# EAGLE schematic Open-Source_Control_V2_R2 (EAGLE 9.3.0)
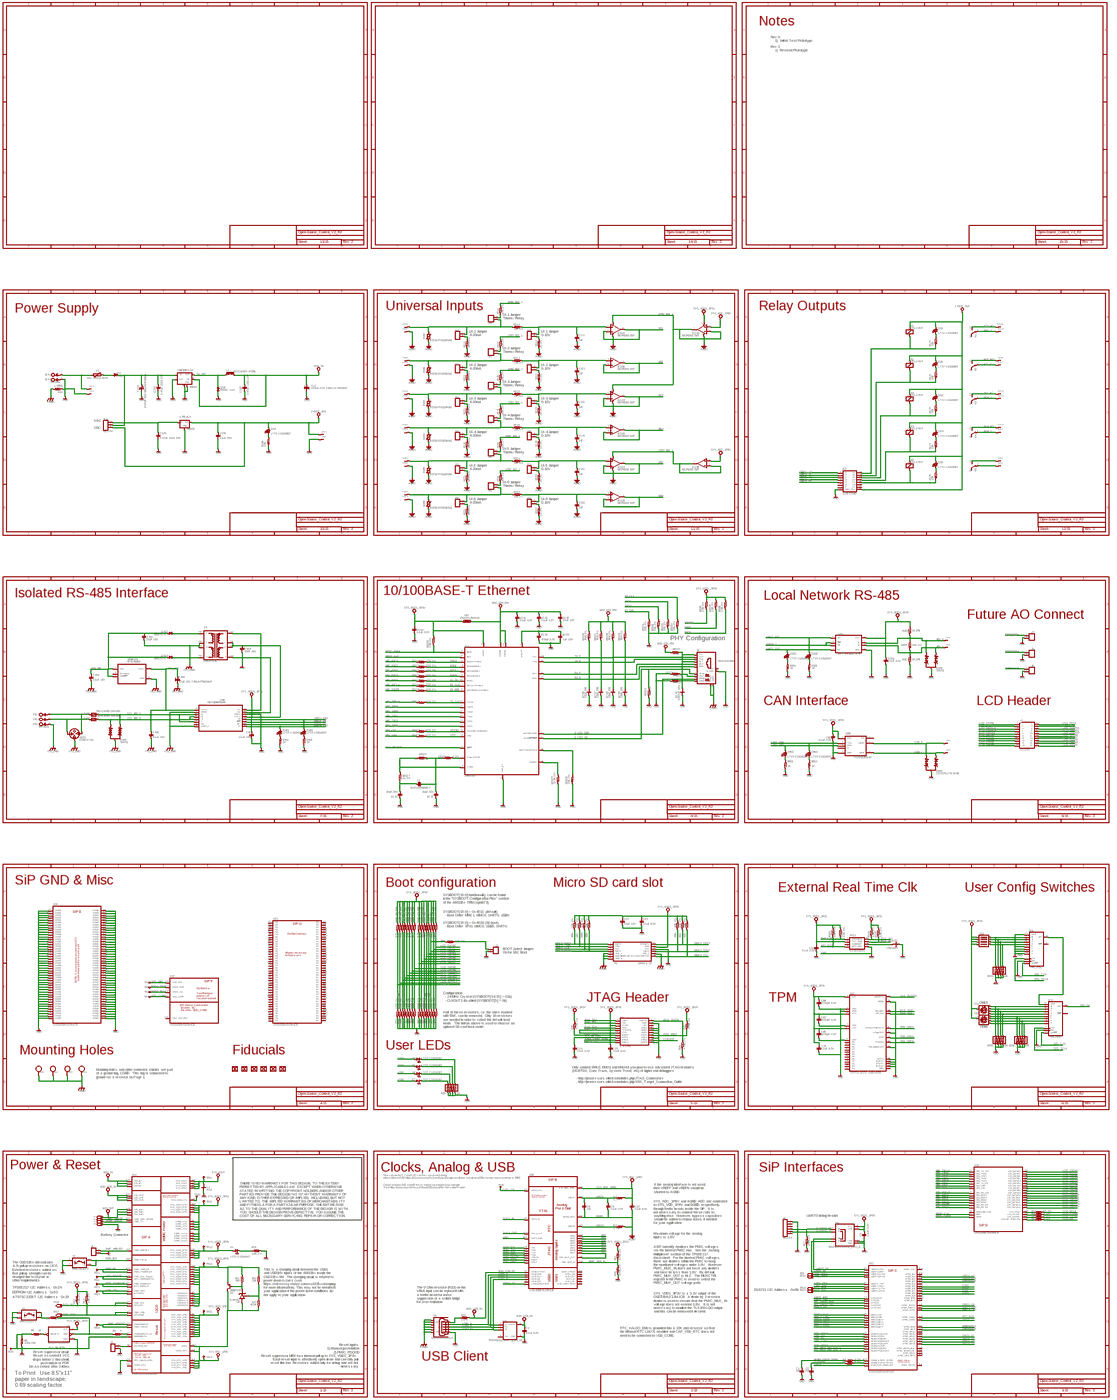
[diagram p0: schematic, sheet 1, overview]
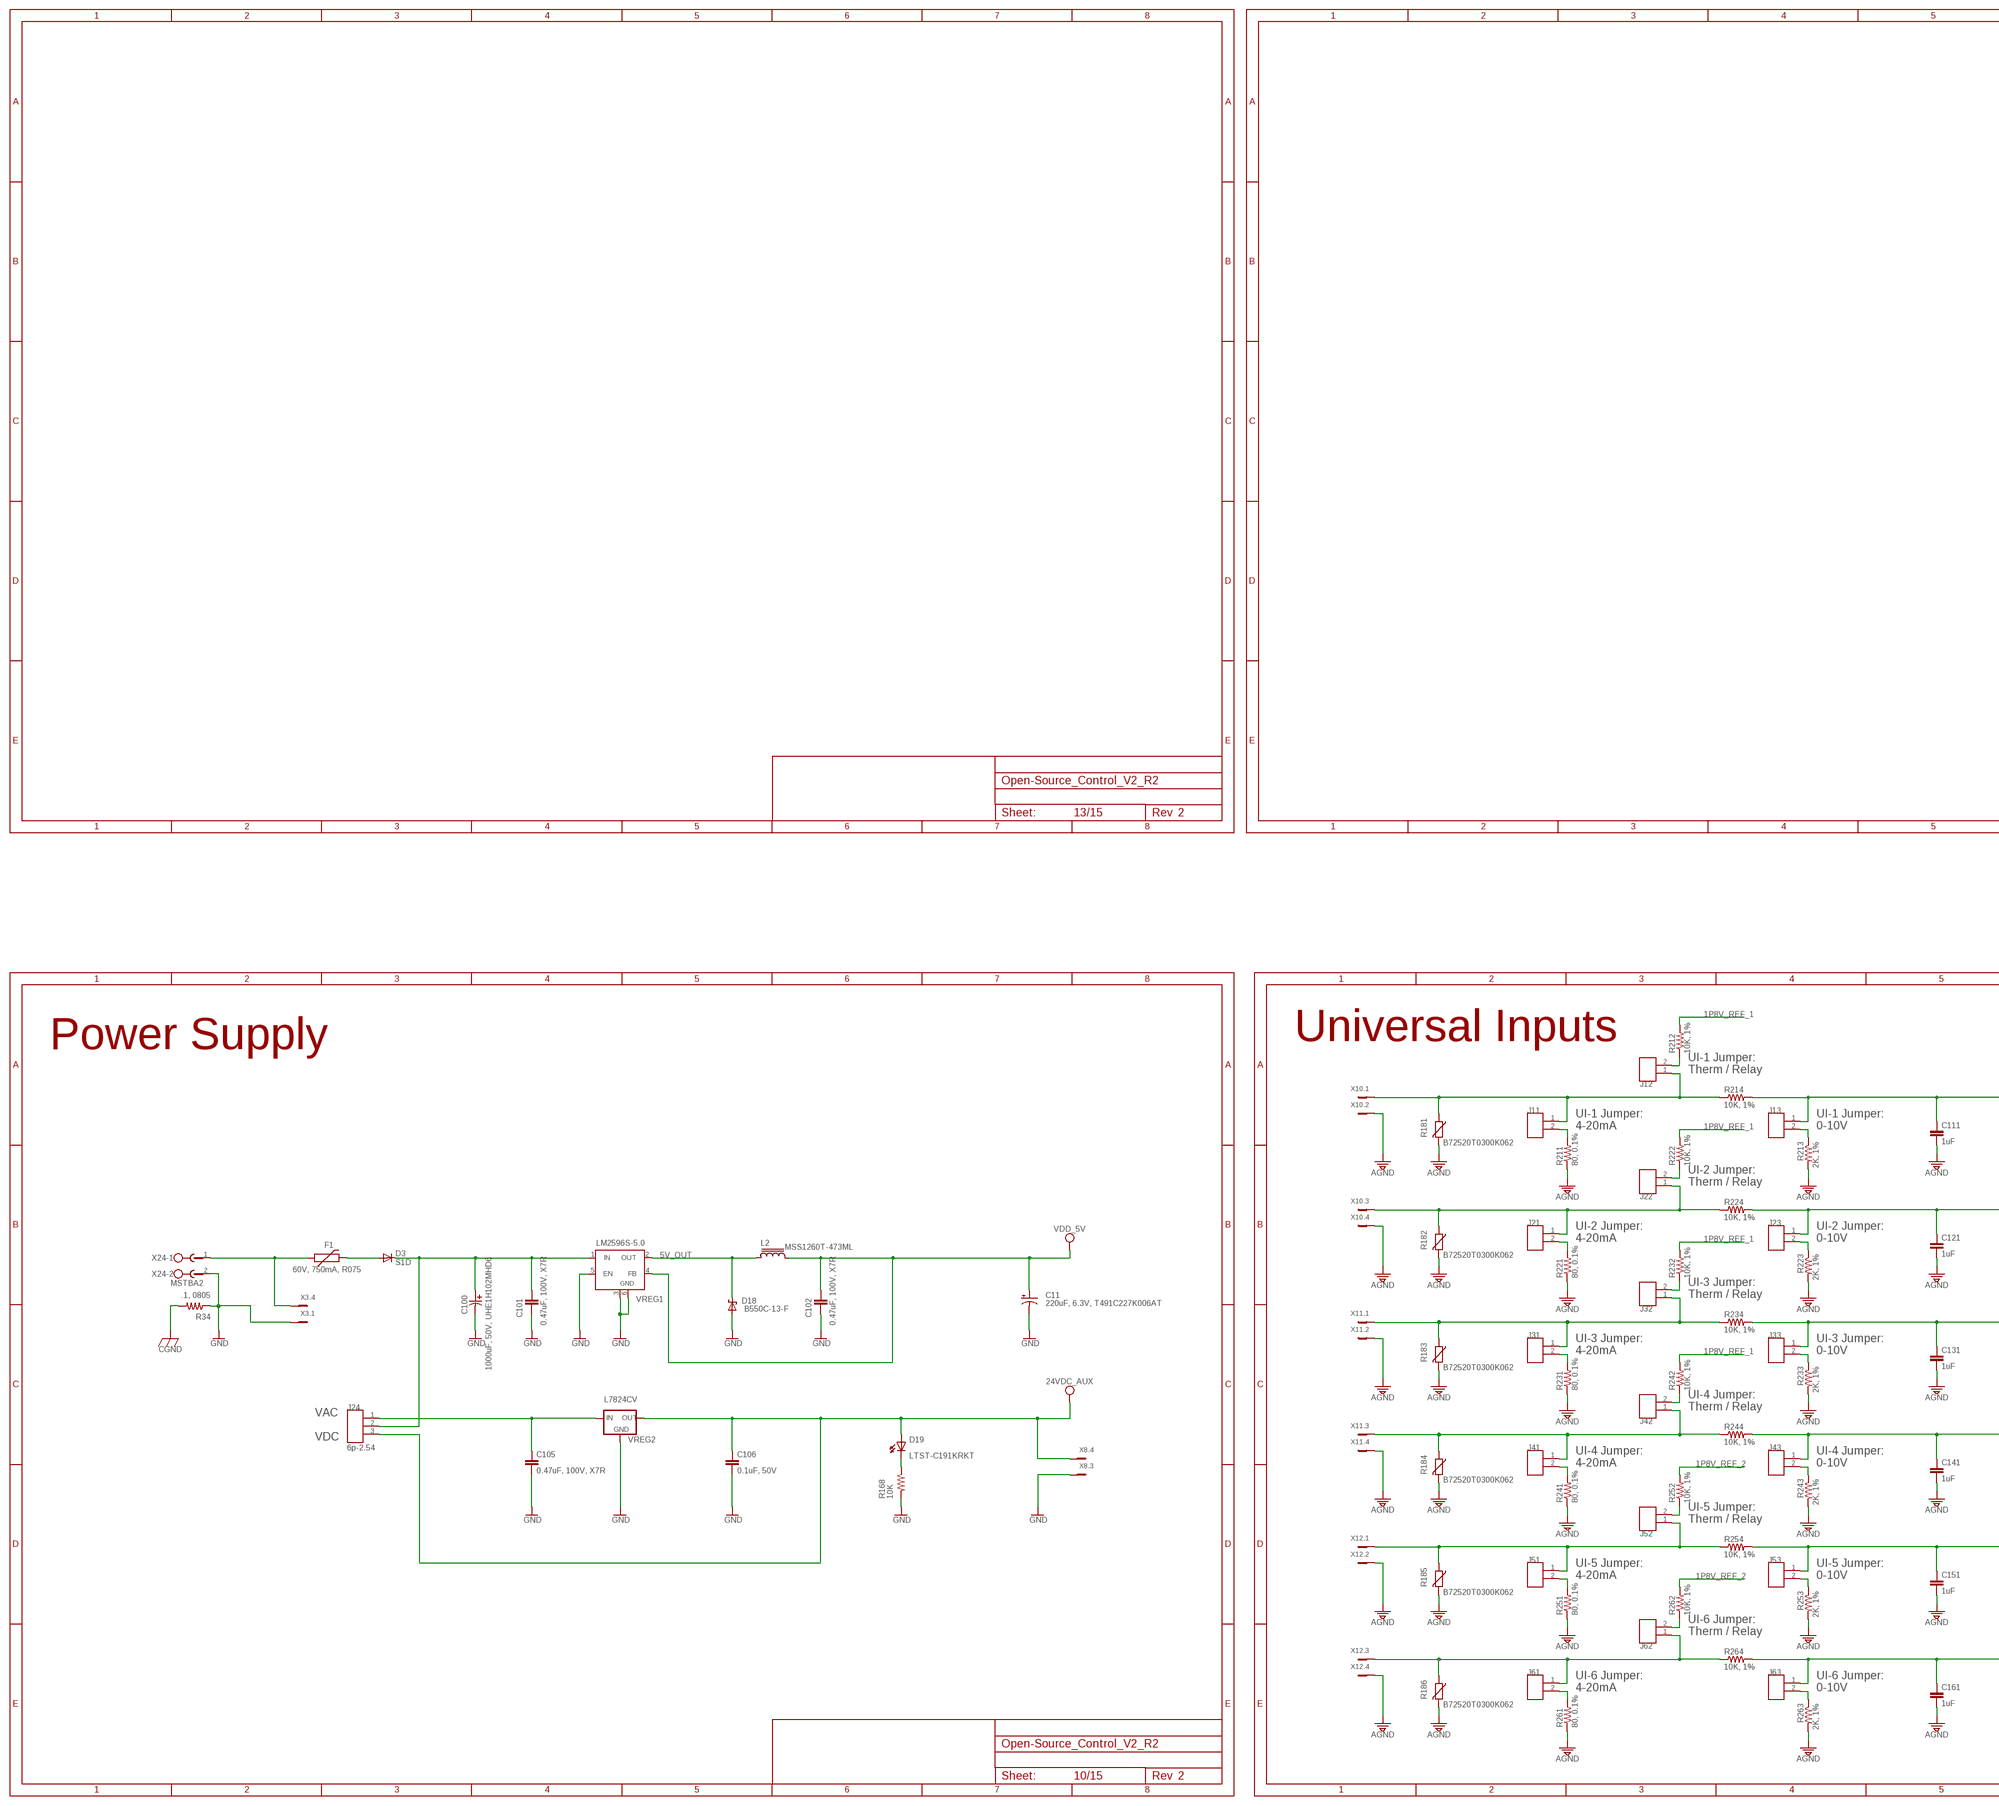
[diagram p1: schematic, sheet 1, part 1 of 6]
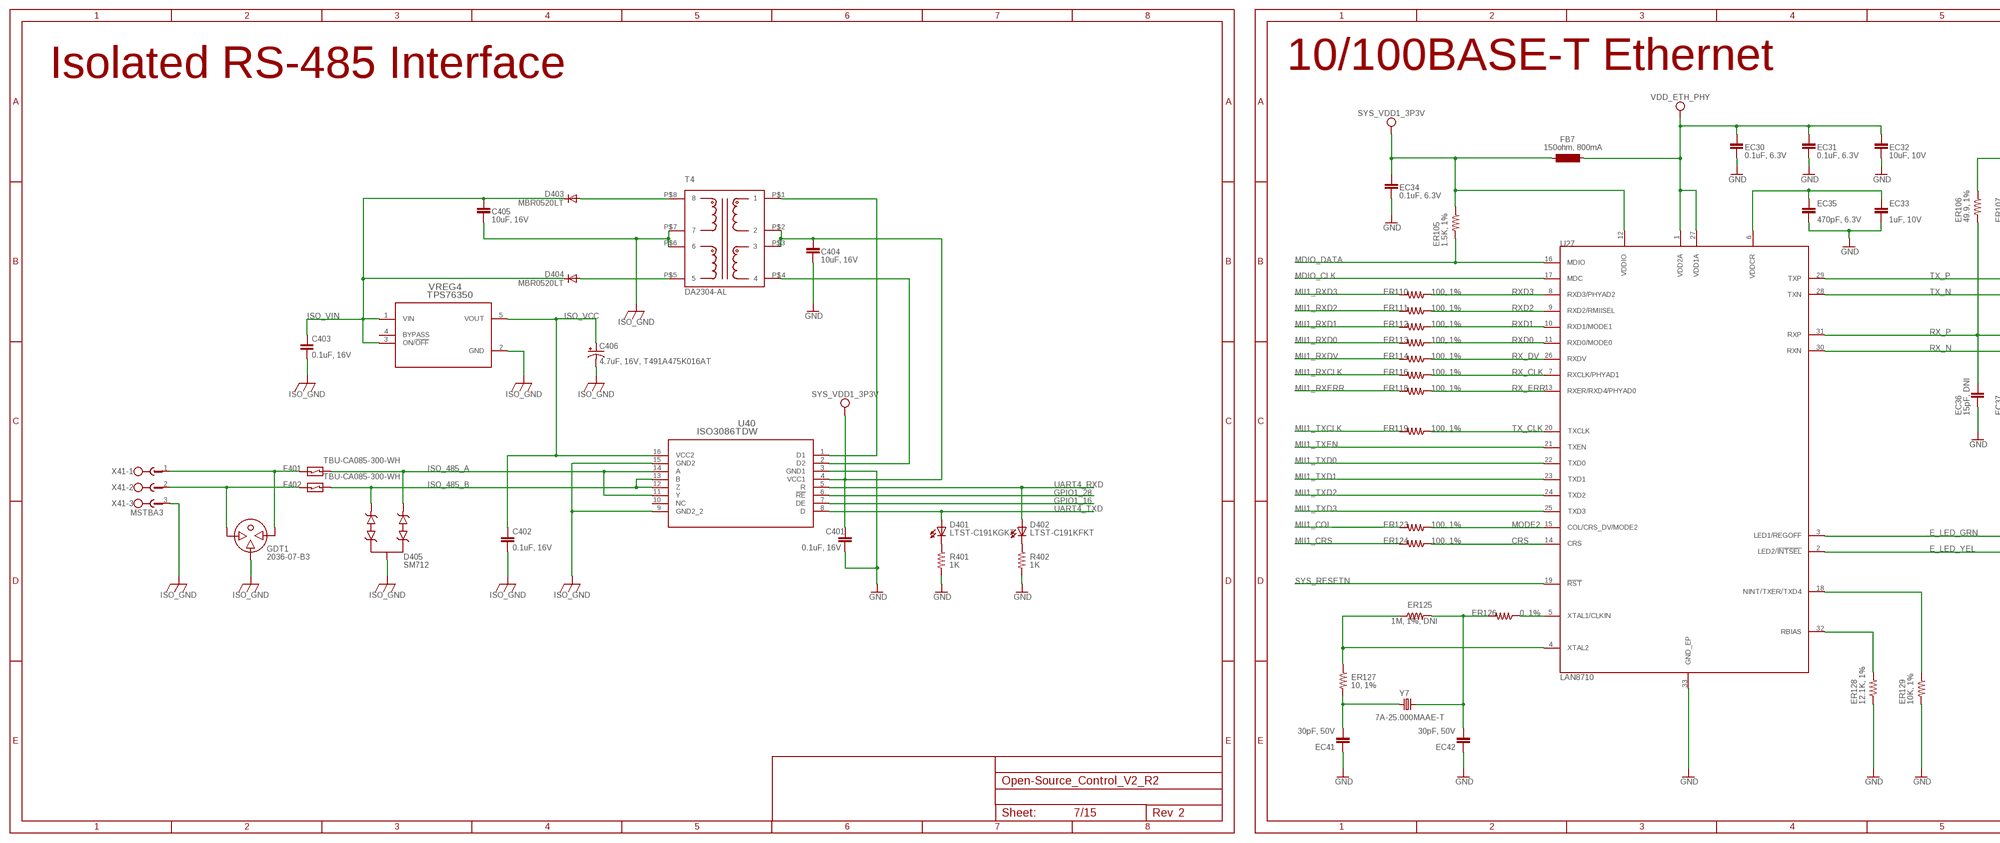
[diagram p2: schematic, sheet 1, part 2 of 6]
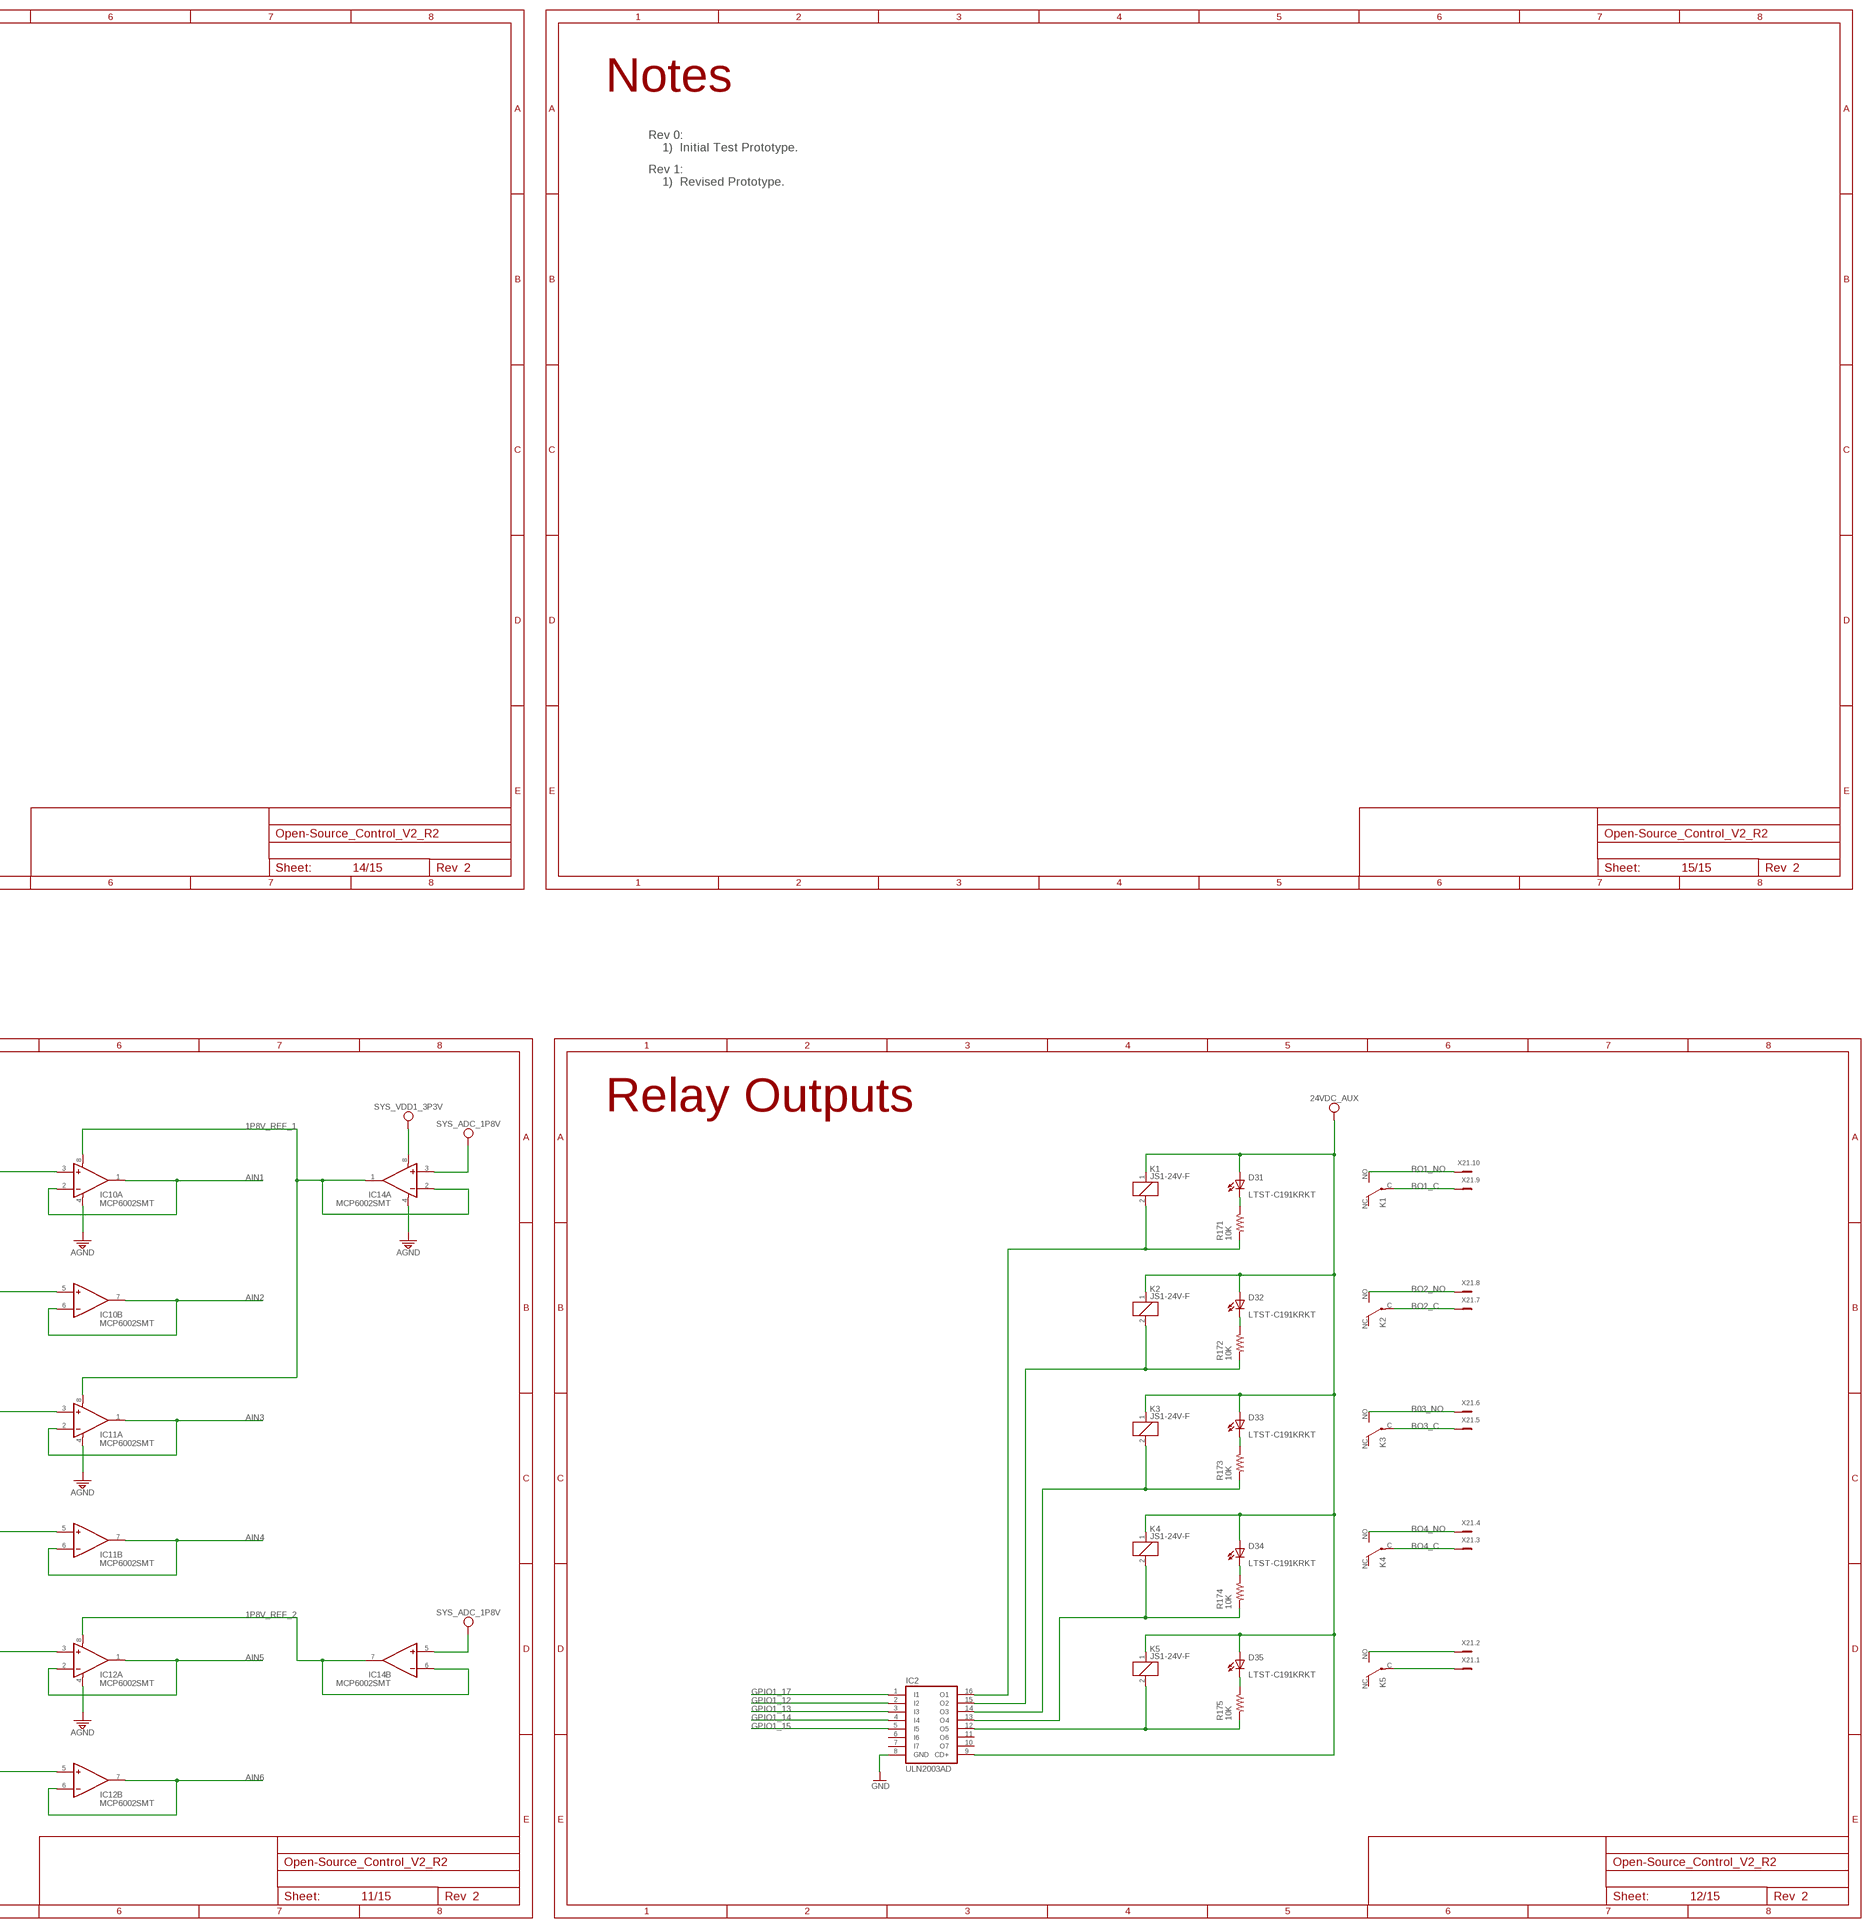
[diagram p3: schematic, sheet 1, part 3 of 6]
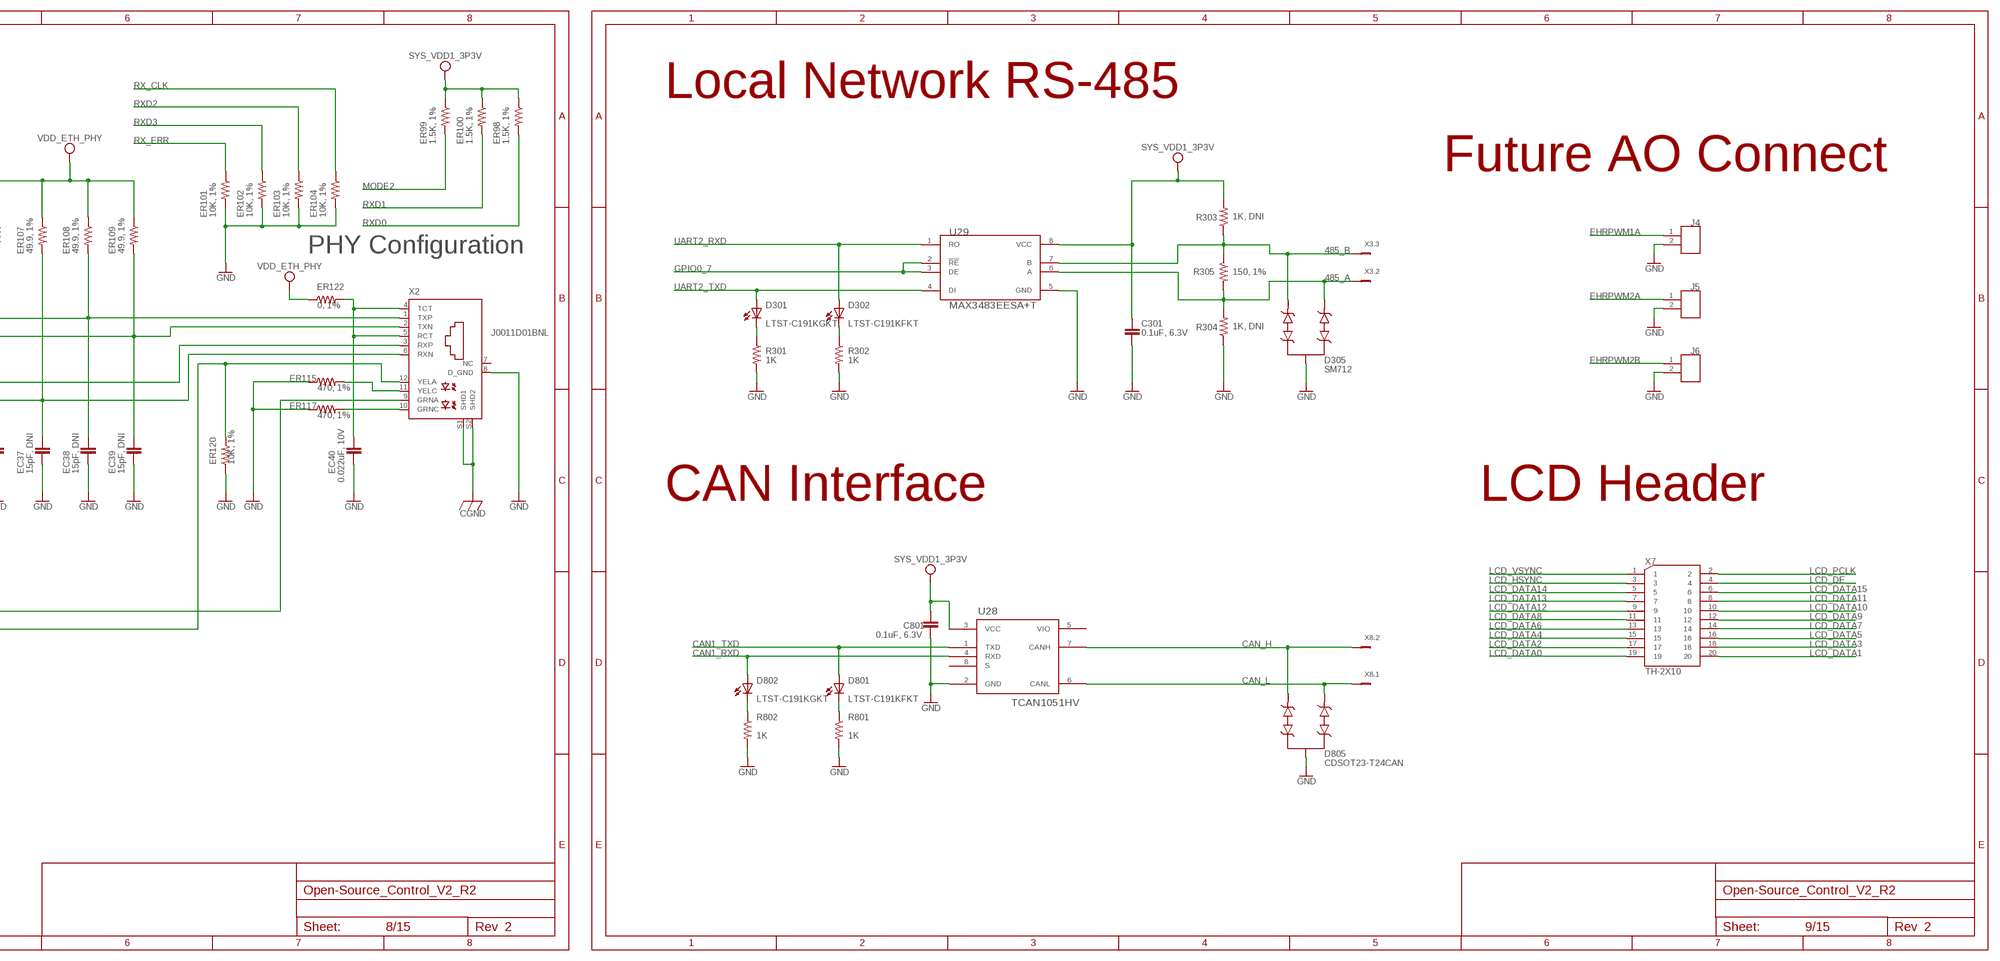
[diagram p4: schematic, sheet 1, part 4 of 6]
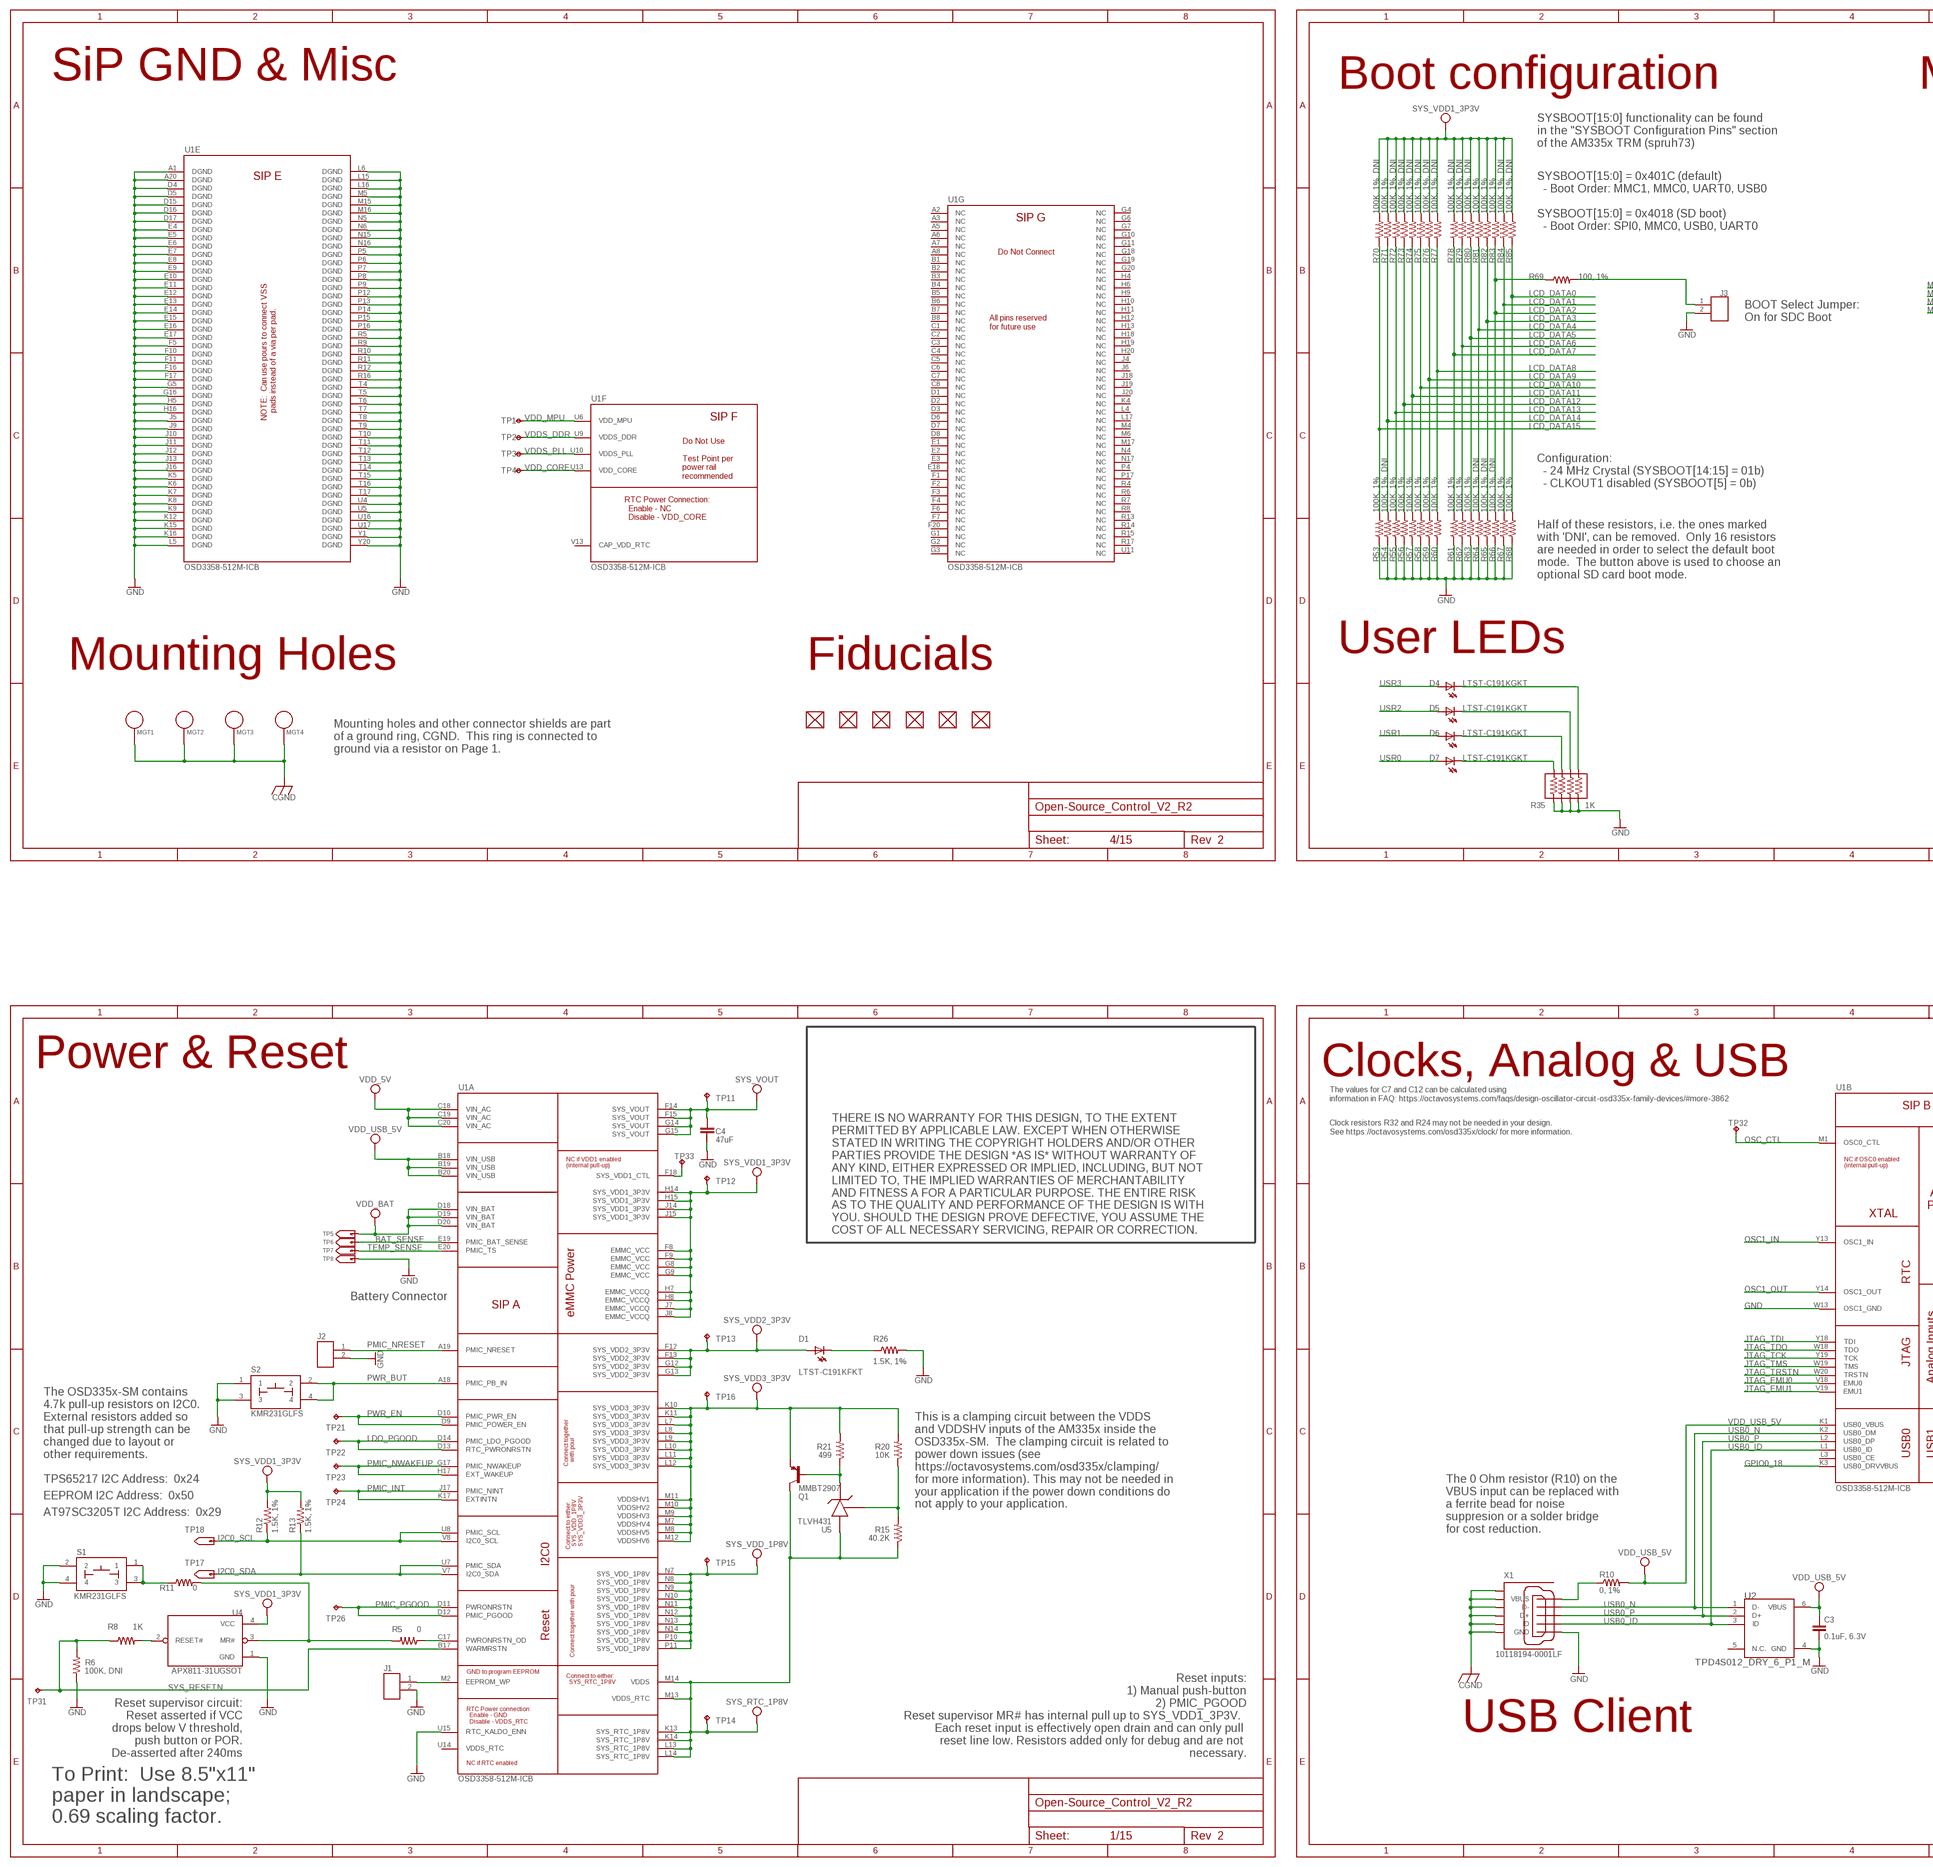
[diagram p5: schematic, sheet 1, part 5 of 6]
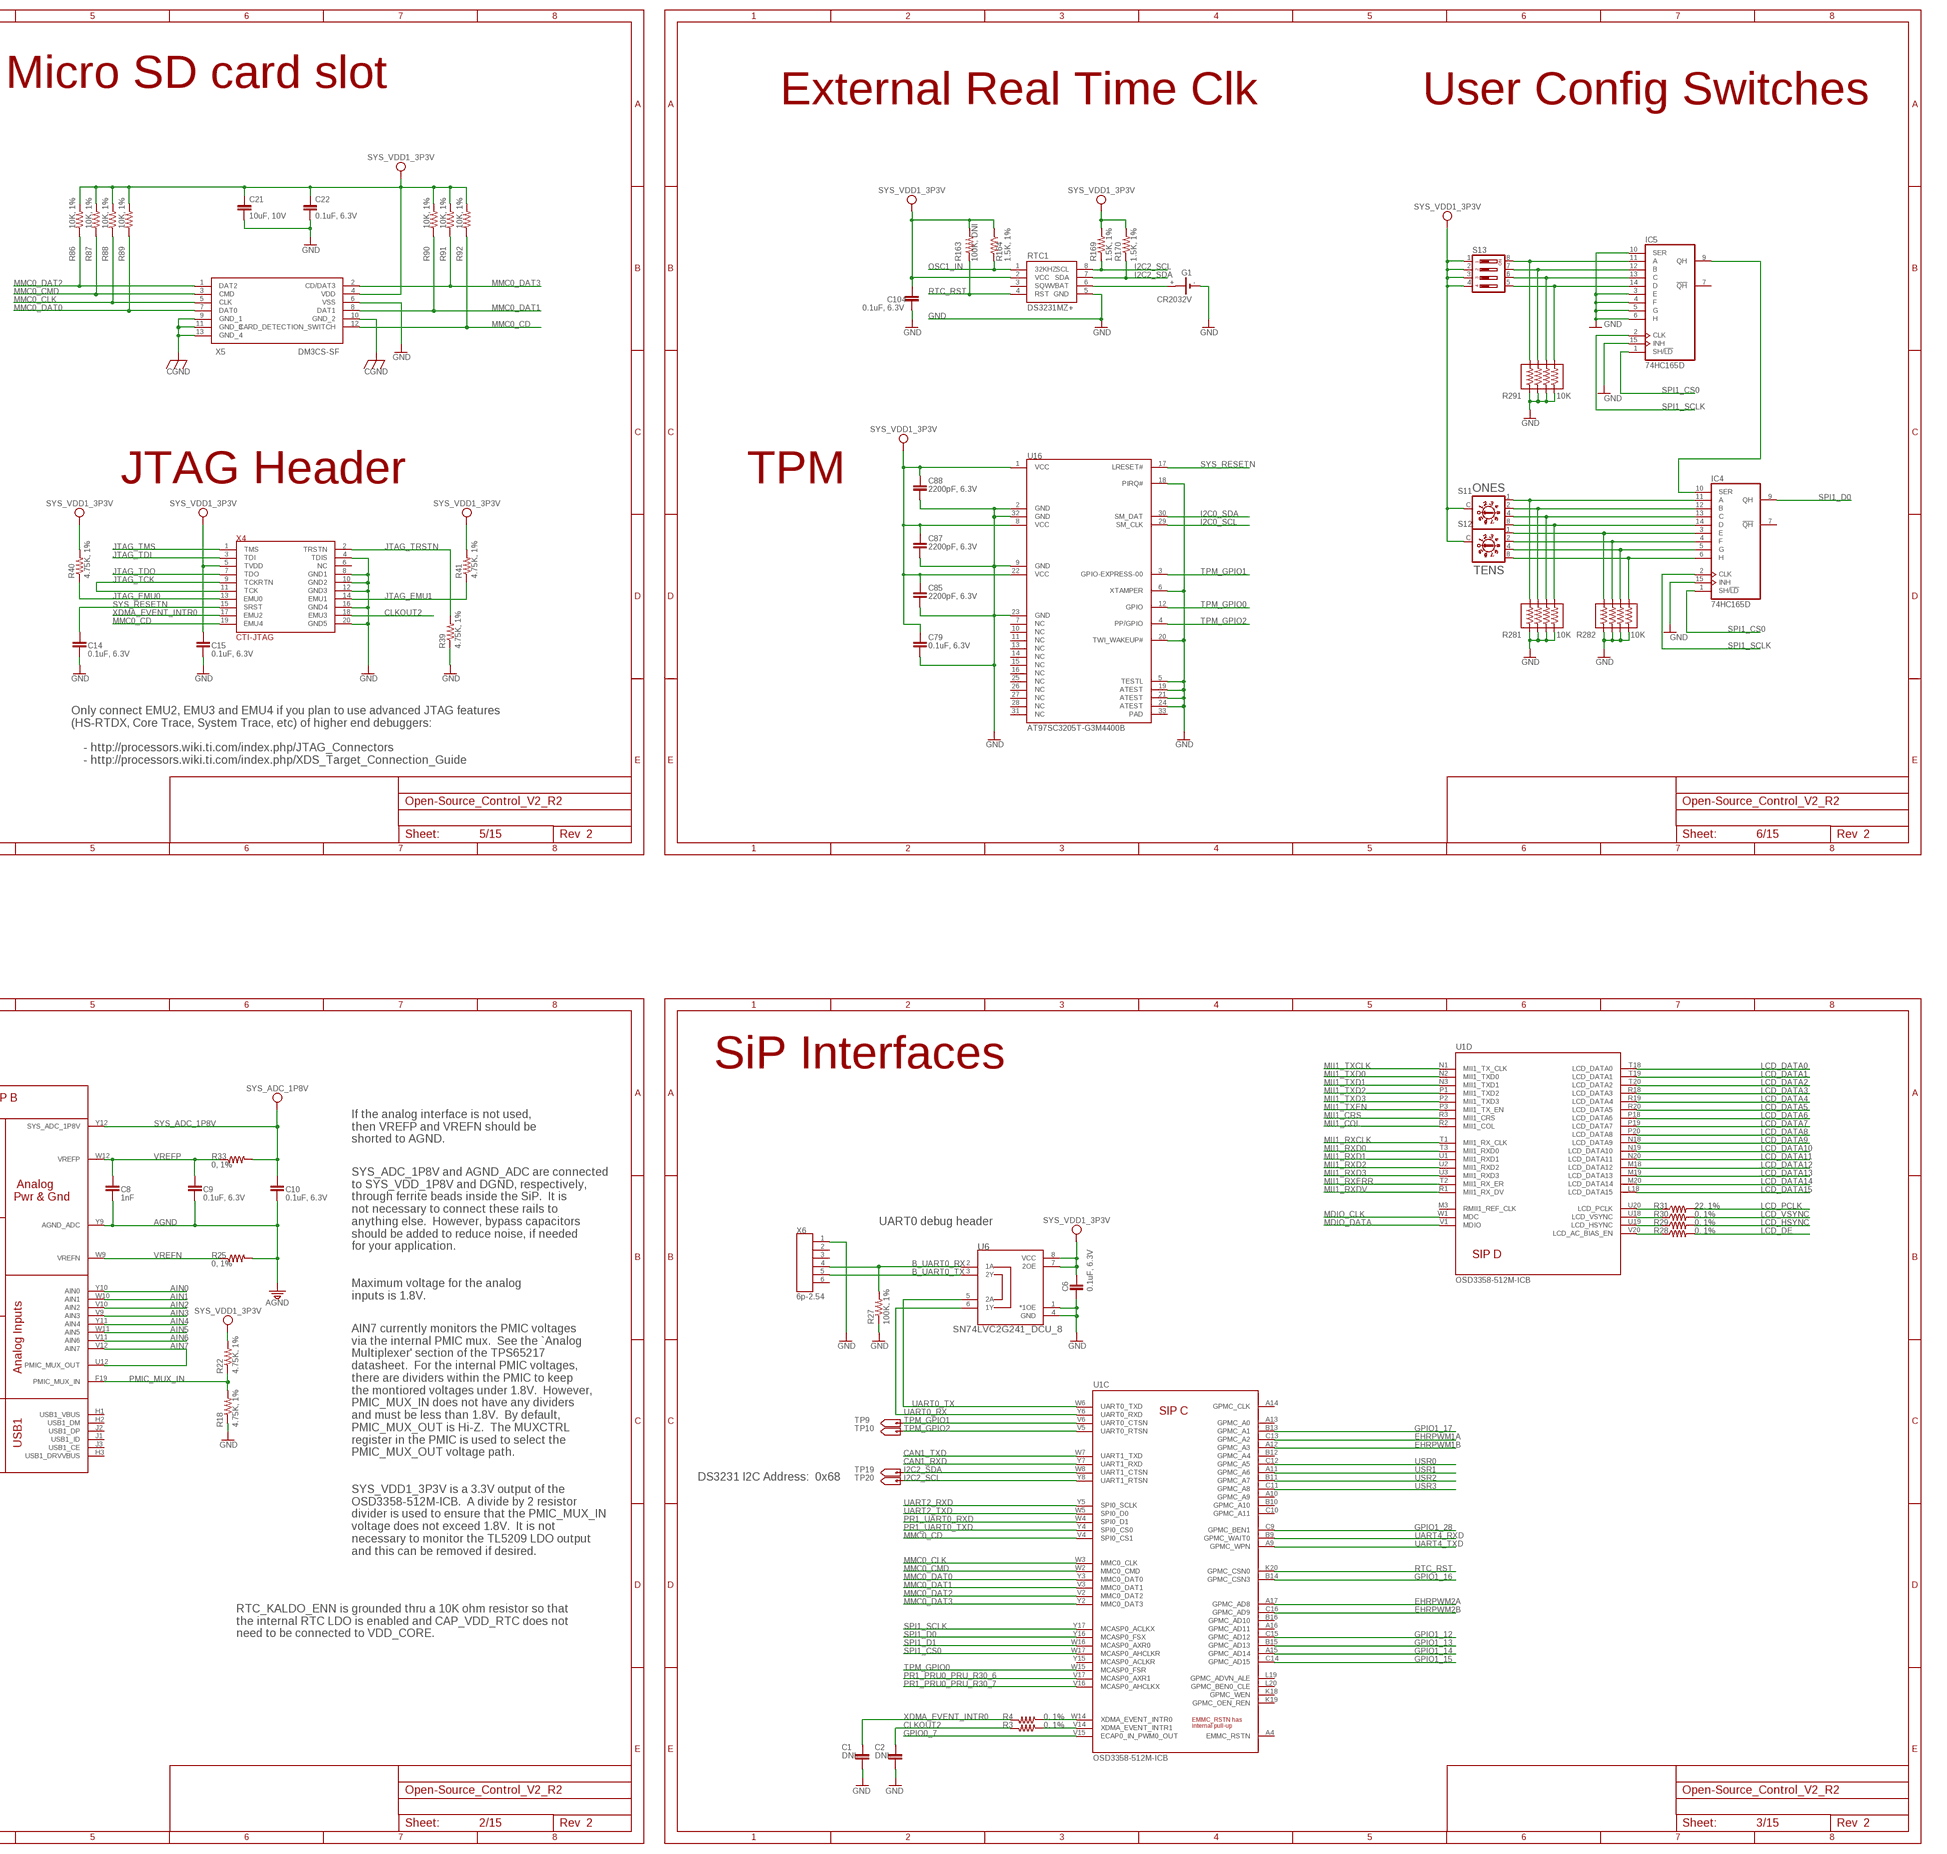
[diagram p6: schematic, sheet 1, part 6 of 6]

## Parts
C1  DNI  CC0603  [C0603]
C2  DNI  CC0603  [C0603]
C3  0.1uF, 6.3V  CC0402  [C0402]
C4  47uF  CC0805  [C0805]
C6  0.1uF, 6.3V  CC0402  [C0402]
C8  1nF  CC0402  [C0402]
C9  0.1uF, 6.3V  CC0402  [C0402]
C10  0.1uF, 6.3V  CC0402  [C0402]
C11  220uF, 6.3V, T491C227K006AT  CPOL-USC/6032-28R  [C/6032-28R]
C14  0.1uF, 6.3V  CC0402  [C0402]
C15  0.1uF, 6.3V  CC0402  [C0402]
C21  10uF, 10V  CC0805  [C0805]
C22  0.1uF, 6.3V  CC0402  [C0402]
C79  0.1uF, 6.3V  CC0402  [C0402]
C85  2200pF, 6.3V  CC0402  [C0402]
C87  2200pF, 6.3V  CC0402  [C0402]
C88  2200pF, 6.3V  CC0402  [C0402]
C100  1000uF, 50V, UHE1H102MHD6  UHE1H102MHD6  [PCAP_16X25-THRU-ELECT]
C101  0.47uF, 100V, X7R  4.7UF-1206-16V-(+80/-20%)  [1206]
C102  0.47uF, 100V, X7R  4.7UF-1206-16V-(+80/-20%)  [1206]
C104  0.1uF, 6.3V  CC0402  [C0402]
C105  0.47uF, 100V, X7R  4.7UF-1206-16V-(+80/-20%)  [1206]
C106  0.1uF, 50V  4.7UF-1206-16V-(+80/-20%)  [1206]
C111  1uF  CC0805  [C0805]
C121  1uF  CC0805  [C0805]
C131  1uF  CC0805  [C0805]
C141  1uF  CC0805  [C0805]
C151  1uF  CC0805  [C0805]
C161  1uF  CC0805  [C0805]
C301  0.1uF, 6.3V  CC0402  [C0402]
C401  0.1uF, 16V  CC0402  [C0402]
C402  0.1uF, 16V  CC0402  [C0402]
C403  0.1uF, 16V  CC0402  [C0402]
C404  10uF, 16V  CC0805  [C0805]
C405  10uF, 16V  CC0805  [C0805]
C406  4.7uF, 16V, T491A475K016AT  CPOL-USA/3216-18R  [A/3216-18R]
C801  0.1uF, 6.3V  CC0402  [C0402]
D1  LTST-C191KFKT  LTST-C191KFKTLED_EIA-STD  [EIA-STD]
D3  S1D  S1M  [SMA]
D4  LTST-C191KGKT  LTST-C191KGKTLED_EIA-STD  [EIA-STD]
D5  LTST-C191KGKT  LTST-C191KGKTLED_EIA-STD  [EIA-STD]
D6  LTST-C191KGKT  LTST-C191KGKTLED_EIA-STD  [EIA-STD]
D7  LTST-C191KGKT  LTST-C191KGKTLED_EIA-STD  [EIA-STD]
D18  B550C-13-F  B520C-13-F  [SMC]
D19  LTST-C191KRKT  LTST-C191KRKTLED_EIA-STD  [EIA-STD]
D31  LTST-C191KRKT  LTST-C191KRKTLED_EIA-STD  [EIA-STD]
D32  LTST-C191KRKT  LTST-C191KRKTLED_EIA-STD  [EIA-STD]
D33  LTST-C191KRKT  LTST-C191KRKTLED_EIA-STD  [EIA-STD]
D34  LTST-C191KRKT  LTST-C191KRKTLED_EIA-STD  [EIA-STD]
D35  LTST-C191KRKT  LTST-C191KRKTLED_EIA-STD  [EIA-STD]
D301  LTST-C191KGKT  LTST-C191KGKTLED_EIA-STD  [EIA-STD]
D302  LTST-C191KFKT  LTST-C191KFKTLED_EIA-STD  [EIA-STD]
D305  SM712  [SOT23-3]
D401  LTST-C191KGKT  LTST-C191KGKTLED_EIA-STD  [EIA-STD]
D402  LTST-C191KFKT  LTST-C191KFKTLED_EIA-STD  [EIA-STD]
D403  MBR0520LT  [SOD123]
D404  MBR0520LT  [SOD123]
D405  SM712  [SOT23-3]
D801  LTST-C191KFKT  LTST-C191KFKTLED_EIA-STD  [EIA-STD]
D802  LTST-C191KGKT  LTST-C191KGKTLED_EIA-STD  [EIA-STD]
D805  CDSOT23-T24CAN  [SOT23-3]
EC30  0.1uF, 6.3V  CC0402  [C0402]
EC31  0.1uF, 6.3V  CC0402  [C0402]
EC32  10uF, 10V  CC0805  [C0805]
EC33  1uF, 10V  CC0402  [C0402]
EC34  0.1uF, 6.3V  CC0402  [C0402]
EC35  470pF, 6.3V  CC0402  [C0402]
EC36  15pF, DNI  CC0402  [C0402]
EC37  15pF, DNI  CC0402  [C0402]
EC38  15pF, DNI  CC0402  [C0402]
EC39  15pF, DNI  CC0402  [C0402]
EC40  0.022uF, 10V  CC0402  [C0402]
EC41  30pF, 50V  CC0402  [C0402]
EC42  30pF, 50V  CC0402  [C0402]
ER98  1.5K, 1%  R-US_R0402  [R0402]
ER99  1.5K, 1%  R-US_R0402  [R0402]
ER100  1.5K, 1%  R-US_R0402  [R0402]
ER101  10K, 1%  R-US_R0402  [R0402]
ER102  10K, 1%  R-US_R0402  [R0402]
ER103  10K, 1%  R-US_R0402  [R0402]
ER104  10K, 1%  R-US_R0402  [R0402]
ER105  1.5K, 1%  R-US_R0402  [R0402]
ER106  49.9, 1%  R-US_R0402  [R0402]
ER107  49.9, 1%  R-US_R0402  [R0402]
ER108  49.9, 1%  R-US_R0402  [R0402]
ER109  49.9, 1%  R-US_R0402  [R0402]
ER110  100, 1%  R-US_R0402  [R0402]
ER111  100, 1%  R-US_R0402  [R0402]
ER112  100, 1%  R-US_R0402  [R0402]
ER113  100, 1%  R-US_R0402  [R0402]
ER114  100, 1%  R-US_R0402  [R0402]
ER115  470, 1%  R-US_R0402  [R0402]
ER116  100, 1%  R-US_R0402  [R0402]
ER117  470, 1%  R-US_R0402  [R0402]
ER118  100, 1%  R-US_R0402  [R0402]
ER119  100, 1%  R-US_R0402  [R0402]
ER120  10K, 1%  R-US_R0402  [R0402]
ER122  0, 1%  R-US_R0402  [R0402]
ER123  100, 1%  R-US_R0402  [R0402]
ER124  100, 1%  R-US_R0402  [R0402]
ER125  1M, 1%, DNI  R-US_R0402  [R0402]
ER126  0, 1%  R-US_R0402  [R0402]
ER127  10, 1%  R-US_R0402  [R0402]
ER128  12.1K, 1%  R-US_R0402  [R0402]
ER129  10K, 1%  R-US_R0402  [R0402]
F1  60V, 750mA, R075  PPTC_PTH  [PTH]
F401  TBU-CA085-300-WH  [TBU-CA]
F402  TBU-CA085-300-WH  [TBU-CA]
FB7  150ohm, 800mA  BLM21AG151SN1DFB_0805  [C0805]
FUD1  FIDUCIAL  [FIDUCIAL_40MIL]
FUD2  FIDUCIAL  [FIDUCIAL_40MIL]
FUD3  FIDUCIAL  [FIDUCIAL_40MIL]
FUD4  FIDUCIAL  [FIDUCIAL_40MIL]
FUD5  FIDUCIAL  [FIDUCIAL_40MIL]
FUD6  FIDUCIAL  [FIDUCIAL_40MIL]
G1  CR2032V  [CR2032V]
GDT1  2036-07-B3  2036-09-B3  [2036-XX-B3]
IC2  ULN2003AD  [SO16]
IC4  74HC165D  [SO16]
IC5  74HC165D  [SO16]
IC10  MCP6002SMT  [SOIC8]
IC11  MCP6002SMT  [SOIC8]
IC12  MCP6002SMT  [SOIC8]
IC14  MCP6002SMT  [SOIC8]
J1  826646-2  [H2-2.54]
J2  826646-2  [H2-2.54]
J3  826646-2  [H2-2.54]
J4  826646-2  [H2-2.54]
J5  826646-2  [H2-2.54]
J6  826646-2  [H2-2.54]
J11  826646-2  [H2-2.54]
J12  826646-2  [H2-2.54]
J13  826646-2  [H2-2.54]
J21  826646-2  [H2-2.54]
J22  826646-2  [H2-2.54]
J23  826646-2  [H2-2.54]
J24  6p-2.54  826646-3  [H3-2.54]
J31  826646-2  [H2-2.54]
J32  826646-2  [H2-2.54]
J33  826646-2  [H2-2.54]
J41  826646-2  [H2-2.54]
J42  826646-2  [H2-2.54]
J43  826646-2  [H2-2.54]
J51  826646-2  [H2-2.54]
J52  826646-2  [H2-2.54]
J53  826646-2  [H2-2.54]
J61  826646-2  [H2-2.54]
J62  826646-2  [H2-2.54]
J63  826646-2  [H2-2.54]
K1  JS1-24V-F  JS-M1-12V-5  [JS-M]
K2  JS1-24V-F  JS-M1-12V-5  [JS-M]
K3  JS1-24V-F  JS-M1-12V-5  [JS-M]
K4  JS1-24V-F  JS-M1-12V-5  [JS-M]
K5  JS1-24V-F  JS-M1-12V-5  [JS-M]
L2  MSS1260T-473ML  MSS1260  [MSS1260]
MGT1  MOUNTING_HOLE  [MOUNTING_HOLE]
MGT2  MOUNTING_HOLE  [MOUNTING_HOLE]
MGT3  MOUNTING_HOLE  [MOUNTING_HOLE]
MGT4  MOUNTING_HOLE  [MOUNTING_HOLE]
Q1  MMBT2907  MMBT2907SMD  [SOT23-BEC]
R3  0, 1%  R-US_R0402  [R0402]
R4  0, 1%  R-US_R0402  [R0402]
R5  0  R-US_R0402  [R0402]
R6  100K, DNI  R-US_R0402  [R0402]
R8  1K  R-US_R0402  [R0402]
R10  0, 1%  R-US_R0805  [R0805]
R11  0  R-US_R0402  [R0402]
R12  1.5K, 1%  R-US_R0402  [R0402]
R13  1.5K, 1%  R-US_R0402  [R0402]
R15  40.2K  R-US_R0402  [R0402]
R18  4.75K, 1%  R-US_R0402  [R0402]
R20  10K  R-US_R0402  [R0402]
R21  499  R-US_R0402  [R0402]
R22  4.75K, 1%  R-US_R0402  [R0402]
R25  0, 1%  R-US_R0402  [R0402]
R26  1.5K, 1%  R-US_R0402  [R0402]
R27  100K, 1%  R-US_R0402  [R0402]
R28  0, 1%  R-US_R0402  [R0402]
R29  0, 1%  R-US_R0402  [R0402]
R30  0, 1%  R-US_R0402  [R0402]
R31  22, 1%  R-US_R0402  [R0402]
R33  0, 1%  R-US_R0402  [R0402]
R34  .1, 0805  R-US_R0805  [R0805]
R35  1K  RESISTOR.NETWORK-(4)  [RN0804]
R39  4.75K, 1%  R-US_R0402  [R0402]
R40  4.75K, 1%  R-US_R0402  [R0402]
R41  4.75K, 1%  R-US_R0402  [R0402]
R53  100K, 1%  R-US_R0402  [R0402]
R54  100K, 1%, DNI  R-US_R0402  [R0402]
R55  100K, 1%  R-US_R0402  [R0402]
R56  100K, 1%  R-US_R0402  [R0402]
R57  100K, 1%  R-US_R0402  [R0402]
R58  100K, 1%  R-US_R0402  [R0402]
R59  100K, 1%  R-US_R0402  [R0402]
R60  100K, 1%  R-US_R0402  [R0402]
R61  100K, 1%  R-US_R0402  [R0402]
R62  100K, 1%  R-US_R0402  [R0402]
R63  100K, 1%  R-US_R0402  [R0402]
R64  100K, 1%, DNI  R-US_R0402  [R0402]
R65  100K, 1%, DNI  R-US_R0402  [R0402]
R66  100K, 1%, DNI  R-US_R0402  [R0402]
R67  100K, 1%  R-US_R0402  [R0402]
R68  100K, 1%  R-US_R0402  [R0402]
R69  100, 1%  R-US_R0402  [R0402]
R70  100K, 1%, DNI  R-US_R0402  [R0402]
R71  100K, 1%  R-US_R0402  [R0402]
R72  100K, 1%, DNI  R-US_R0402  [R0402]
R73  100K, 1%, DNI  R-US_R0402  [R0402]
R74  100K, 1%, DNI  R-US_R0402  [R0402]
R75  100K, 1%, DNI  R-US_R0402  [R0402]
R76  100K, 1%, DNI  R-US_R0402  [R0402]
R77  100K, 1%, DNI  R-US_R0402  [R0402]
R78  100K, 1%, DNI  R-US_R0402  [R0402]
R79  100K, 1%, DNI  R-US_R0402  [R0402]
R80  100K, 1%, DNI  R-US_R0402  [R0402]
R81  100K, 1%  R-US_R0402  [R0402]
R82  100K, 1%  R-US_R0402  [R0402]
R83  100K, 1%  R-US_R0402  [R0402]
R84  100K, 1%, DNI  R-US_R0402  [R0402]
R85  100K, 1%, DNI  R-US_R0402  [R0402]
R86  10K, 1%  R-US_R0402  [R0402]
R87  10K, 1%  R-US_R0402  [R0402]
R88  10K, 1%  R-US_R0402  [R0402]
R89  10K, 1%  R-US_R0402  [R0402]
R90  10K, 1%  R-US_R0402  [R0402]
R91  10K, 1%  R-US_R0402  [R0402]
R92  10K, 1%  R-US_R0402  [R0402]
R163  100K, DNI  R-US_R0402  [R0402]
R164  1.5K, 1%  R-US_R0402  [R0402]
R168  10K  R-US_R0402  [R0402]
R169  1.5K, 1%  R-US_R0402  [R0402]
R170  1.5K, 1%  R-US_R0402  [R0402]
R171  10K  R-US_R0402  [R0402]
R172  10K  R-US_R0402  [R0402]
R173  10K  R-US_R0402  [R0402]
R174  10K  R-US_R0402  [R0402]
R175  10K  R-US_R0402  [R0402]
R181  B72520T0300K062  VARISTORCN1206  [CT/CN1206]
R182  B72520T0300K062  VARISTORCN1206  [CT/CN1206]
R183  B72520T0300K062  VARISTORCN1206  [CT/CN1206]
R184  B72520T0300K062  VARISTORCN1206  [CT/CN1206]
R185  B72520T0300K062  VARISTORCN1206  [CT/CN1206]
R186  B72520T0300K062  VARISTORCN1206  [CT/CN1206]
R211  80, 0.1%  R-US_0309/12  [0309/12]
R212  10K, 1%  R-US_R0805  [R0805]
R213  2K, 1%  R-US_R0805  [R0805]
R214  10K, 1%  R-US_R0805  [R0805]
R221  80, 0.1%  R-US_0309/12  [0309/12]
R222  10K, 1%  R-US_R0805  [R0805]
R223  2K, 1%  R-US_R0805  [R0805]
R224  10K, 1%  R-US_R0805  [R0805]
R231  80, 0.1%  R-US_0309/12  [0309/12]
R232  10K, 1%  R-US_R0805  [R0805]
R233  2K, 1%  R-US_R0805  [R0805]
R234  10K, 1%  R-US_R0805  [R0805]
R241  80, 0.1%  R-US_0309/12  [0309/12]
R242  10K, 1%  R-US_R0805  [R0805]
R243  2K, 1%  R-US_R0805  [R0805]
R244  10K, 1%  R-US_R0805  [R0805]
R251  80, 0.1%  R-US_0309/12  [0309/12]
R252  10K, 1%  R-US_R0805  [R0805]
R253  2K, 1%  R-US_R0805  [R0805]
R254  10K, 1%  R-US_R0805  [R0805]
R261  80, 0.1%  R-US_0309/12  [0309/12]
R262  10K, 1%  R-US_R0805  [R0805]
R263  2K, 1%  R-US_R0805  [R0805]
R264  10K, 1%  R-US_R0805  [R0805]
R281  10K  RESISTOR.NETWORK-(4)  [RN0804]
R282  10K  RESISTOR.NETWORK-(4)  [RN0804]
R291  10K  RESISTOR.NETWORK-(4)  [RN0804]
R301  1K  R-US_R0402  [R0402]
R302  1K  R-US_R0402  [R0402]
R303  1K, DNI  R-US_R0402  [R0402]
R304  1K, DNI  R-US_R0402  [R0402]
R305  150, 1%  R-US_R0805  [R0805]
R401  1K  R-US_R0402  [R0402]
R402  1K  R-US_R0402  [R0402]
R801  1K  R-US_R0402  [R0402]
R802  1K  R-US_R0402  [R0402]
RTC1  DS3231MZ+  DS3231M  [SO08]
S1  KMR231GLFS  [SW4SMD_63X161LS]
S2  KMR231GLFS  [SW4SMD_63X161LS]
S11  P101  [P101]
S12  P101  [P101]
S13  DS04  [DS-04]
T4  DA2304-AL  [DA230X-AL]
TP1  TPB0,65  [TP_B0,65]
TP2  TPB0,65  [TP_B0,65]
TP3  TPB0,65  [TP_B0,65]
TP4  TPB0,65  [TP_B0,65]
TP5  TESTPAD/W_HOLE_1X1  [TESTPAD/W_HOLE_1X1]
TP6  TESTPAD/W_HOLE_1X1  [TESTPAD/W_HOLE_1X1]
TP7  TESTPAD/W_HOLE_1X1  [TESTPAD/W_HOLE_1X1]
TP8  TESTPAD/W_HOLE_1X1  [TESTPAD/W_HOLE_1X1]
TP9  TESTPAD/W_HOLE_1X1  [TESTPAD/W_HOLE_1X1]
TP10  TESTPAD/W_HOLE_1X1  [TESTPAD/W_HOLE_1X1]
TP11  TPB0,65  [TP_B0,65]
TP12  TPB0,65  [TP_B0,65]
TP13  TPB0,65  [TP_B0,65]
TP14  TPB0,65  [TP_B0,65]
TP15  TPB0,65  [TP_B0,65]
TP16  TPB0,65  [TP_B0,65]
TP17  TESTPAD/W_HOLE_1X1  [TESTPAD/W_HOLE_1X1]
TP18  TESTPAD/W_HOLE_1X1  [TESTPAD/W_HOLE_1X1]
TP19  TESTPAD/W_HOLE_1X1  [TESTPAD/W_HOLE_1X1]
TP20  TESTPAD/W_HOLE_1X1  [TESTPAD/W_HOLE_1X1]
TP21  TPB0,65  [TP_B0,65]
TP22  TPB0,65  [TP_B0,65]
TP23  TPB0,65  [TP_B0,65]
TP24  TPB0,65  [TP_B0,65]
TP26  TPB0,65  [TP_B0,65]
TP31  TPB0,65  [TP_B0,65]
TP32  TPB0,65  [TP_B0,65]
TP33  TPB0,65  [TP_B0,65]
U1  OSD3358-512M-ICB  [OSD335X-BGA-400]
U2  TPD4S012_DRY_6_P1_M  [DRY6]
U4  APX811-31UGSOT  [SOT143-R]
U5  TLVH431  [SOT23-3]
U6  SN74LVC2G241_DCU_8  [DCU8]
U16  AT97SC3205T-G3M4400B  [QFN32-0.4-4X4MM]
U27  LAN8710  [LAN8710A-QFN32]
U28  TCAN1051HV  [BEAGLEBONE_BLUE_D8]
U29  MAX3483EESA+T  [21-0041B_8]
U40  ISO3086TDW  [DW16]
VREG1  LM2596S-5.0  LM2596S  [TO263-5]
VREG2  L7824CV  78XXL  [78XXL]
VREG4  TPS76350  LP2985A-33DBVR  [DBV5]
X1  10118194-0001LF  [10118194-0001LF(MICRO-USB-B-AMPHENOL-FCI)]
X2  J0011D01BNL  [J0011D01BNL]
X3  MC4  [MC4]
X4  CTI-JTAG  [CTI-JTAG]
X5  DM3CS-SF  [DM3CS-SF]
X6  6p-2.54  826646-6  [H6-2.54]
X7  TH-2X10  [H2X10-2.54]
X8  MC4  [MC4]
X10  MC4  [MC4]
X11  MC4  [MC4]
X12  MC4  [MC4]
X21  MC10  [MC10]
X24  MSTBA2  [MSTBA2]
X41  MSTBA3  [MSTBA3]
Y7  7A-25.000MAAE-T  [CRYSTAL-TXC-7A]

## Nets
1P8V_REF_1: IC10.8(A:V+) IC11.8(A:V+) IC14.1(A:OUT) IC14.2(A:-IN) R212.2 R222.2 R232.2 R242.2
1P8V_REF_2: IC12.8(A:V+) IC14.6(B:-IN) IC14.7(B:OUT) R252.2 R262.2
5V_OUT: D18.C L2.1 VREG1.2(OUT)
24VAC: D3.A F1.P$2
24VAC_IN: F1.P$1 X3.4 X24.1
24VDC_AUX: C106.1 D19.1(A) D31.1(A) D32.1(A) D33.1(A) D34.1(A) D35.1(A) IC2.9(CD+) J24.3 K1.1 K2.1 K3.1 K4.1 K5.1 VREG2.OUT X8.4
24VDC_UNREG: C100.1 C101.1 D3.C J24.2 VREG1.1(IN)
41_A: F401.1 GDT1.2 X41.1
41_B: F402.1 GDT1.1 X41.2
485_A: D305.1 R304.2 R305.2 U29.6(A) X3.2
485_B: D305.2 R303.1 R305.1 U29.7(B) X3.3
AGND: C8.2 C9.2 C10.2 C111.2 C121.2 C131.2 C141.2 C151.2 C161.2 IC10.4(A:V-) IC11.4(A:V-) IC12.4(A:V-) IC14.4(A:V-) R25.2 R181.2 R182.2 R183.2 R184.2 R185.2 R186.2 R211.1 R213.2 R221.1 R223.2 R231.1 R233.2 R241.1 R243.2 R251.1 R253.2 R261.1 R263.2 U1.Y9(B:AGND_ADC) X10.2 X10.4 X11.2 X11.4 X12.2 X12.4
AIN0: U1.Y10(B:AIN0)
AIN1: IC10.1(A:OUT) IC10.2(A:-IN) U1.W10(B:AIN1)
AIN2: IC10.6(B:-IN) IC10.7(B:OUT) U1.V10(B:AIN2)
AIN3: IC11.1(A:OUT) IC11.2(A:-IN) U1.V9(B:AIN3)
AIN4: IC11.6(B:-IN) IC11.7(B:OUT) U1.Y11(B:AIN4)
AIN5: IC12.1(A:OUT) IC12.2(A:-IN) U1.W11(B:AIN5)
AIN6: IC12.6(B:-IN) IC12.7(B:OUT) U1.V11(B:AIN6)
AIN7: U1.U12(B:PMIC_MUX_OUT) U1.V12(B:AIN7)
B03_NO: K3.NO(2:S) X21.6
B_UART0_RX: R27.2 U6.2(1A) X6.4
B_UART0_TX: U6.3(2Y) X6.5
BAT_SENSE: TP6.P$1(TP) U1.E19(A:PMIC_BAT_SENSE)
BO1_C: K1.C(2:P) X21.9
BO1_NO: K1.NO(2:S) X21.10
BO2_C: K2.C(2:P) X21.7
BO2_NO: K2.NO(2:S) X21.8
BO3_C: K3.C(2:P) X21.5
BO4_C: K4.C(2:P) X21.3
BO4_NO: K4.NO(2:S) X21.4
BO5_C: K5.C(2:P) X21.1
BO5_NO: K5.NO(2:S) X21.2
CAN1_RXD: D802.1(A) U1.Y7(C:UART1_RXD) U28.4(RXD)
CAN1_TXD: D801.1(A) U1.W7(C:UART1_TXD) U28.1(TXD)
CAN_H: D805.2 U28.7(CANH) X8.2
CAN_L: D805.1 U28.6(CANL) X8.1
CGND: MGT1.P$1 MGT2.P$1 MGT3.P$1 MGT4.P$1 R34.2 X1.CGND1(SGND1) X1.CGND2(SGND2) X1.CGND3(SGND3) X1.CGND4(SGND4) X1.CGND5(SGND5) X1.CGND6(SGND6) X2.S1(SHD1) X2.S2(SHD2) X5.9(GND_1) X5.10(GND_2) X5.11(GND_3) X5.13(GND_4)
CLKOUT2: C2.2 R3.2 X4.18(EMU3)
CRS: ER124.1 U27.14(CRS)
E_LED_GRN: U27.3(LED1/REGOFF) X2.9(GRNA)
E_LED_YEL: ER120.2 U27.2(LED2/!INTSEL) X2.12(YELA)
EEPROM_WP: J1.1 U1.M2(A:EEPROM_WP)
EHRPWM1A: J4.1 U1.C13(C:GPMC_A2)
EHRPWM1B: U1.A12(C:GPMC_A3)
EHRPWM2A: J5.1 U1.A17(C:GPMC_AD8)
EHRPWM2B: J6.1 U1.C16(C:GPMC_AD9)
GND: C1.1 C2.1 C3.2 C4.2 C6.1 C11.- C14.2 C15.2 C21.2 C22.2 C79.2 C85.2 C87.2 C88.2 C100.2 C101.2 C102.2 C104.2 C105.2 C106.2 C301.2 C401.2 C404.2 C801.2 D18.A D305.3 D805.3 EC30.2 EC31.2 EC32.2 EC33.2 EC34.2 EC35.2 EC36.2 EC37.2 EC38.2 EC39.2 EC40.2 EC41.2 EC42.2 ER101.2 ER102.2 ER103.2 ER104.2 ER115.1 ER117.1 ER120.1 ER128.1 ER129.2 G1.- IC2.8(GND) IC4.15(INH) IC5.3(E) IC5.4(F) IC5.5(G) IC5.6(H) IC5.10(SER) IC5.15(INH) J1.2 J2.2 J3.2 J4.2 J5.2 J6.2 R6.1 R18.1 R26.2 R27.1 R34.1 R35.1 R35.2 R35.3 R35.4 R39.1 R53.1 R54.1 R55.1 R56.1 R57.1 R58.1 R59.1 R60.1 R61.1 R62.1 R63.1 R64.1 R65.1 R66.1 R67.1 R68.1 R168.2 R281.1 R281.2 R281.3 R281.4 R282.1 R282.2 R282.3 R282.4 R291.1 R291.2 R291.3 R291.4 R301.2 R302.2 R304.1 R401.2 R402.2 R801.2 R802.2 RTC1.5(GND) S1.2 S1.4 S2.1 S2.3 TP8.P$1(TP) U1.A1(E:DGND) U1.A20(E:DGND) U1.D4(E:DGND) U1.D5(E:DGND) U1.D15(E:DGND) U1.D16(E:DGND) U1.D17(E:DGND) U1.E4(E:DGND) U1.E5(E:DGND) U1.E6(E:DGND) U1.E7(E:DGND) U1.E8(E:DGND) U1.E9(E:DGND) U1.E10(E:DGND) U1.E11(E:DGND) U1.E12(E:DGND) U1.E13(E:DGND) U1.E14(E:DGND) U1.E15(E:DGND) U1.E16(E:DGND) U1.E17(E:DGND) U1.F5(E:DGND) U1.F10(E:DGND) U1.F11(E:DGND) U1.F16(E:DGND) U1.F17(E:DGND) U1.G5(E:DGND) U1.G16(E:DGND) U1.H5(E:DGND) U1.H16(E:DGND) U1.J5(E:DGND) U1.J9(E:DGND) U1.J10(E:DGND) U1.J11(E:DGND) U1.J12(E:DGND) U1.J13(E:DGND) U1.J16(E:DGND) U1.K5(E:DGND) U1.K6(E:DGND) U1.K7(E:DGND) U1.K8(E:DGND) U1.K9(E:DGND) U1.K12(E:DGND) U1.K15(E:DGND) U1.K16(E:DGND) U1.L5(E:DGND) U1.L6(E:DGND) U1.L15(E:DGND) U1.L16(E:DGND) U1.M5(E:DGND) U1.M15(E:DGND) U1.M16(E:DGND) U1.N5(E:DGND) U1.N6(E:DGND) U1.N15(E:DGND) U1.N16(E:DGND) U1.P5(E:DGND) U1.P6(E:DGND) U1.P7(E:DGND) U1.P8(E:DGND) U1.P9(E:DGND) U1.P12(E:DGND) U1.P13(E:DGND) U1.P14(E:DGND) U1.P15(E:DGND) U1.P16(E:DGND) U1.R5(E:DGND) U1.R9(E:DGND) U1.R10(E:DGND) U1.R11(E:DGND) U1.R12(E:DGND) U1.R16(E:DGND) U1.T4(E:DGND) U1.T5(E:DGND) U1.T6(E:DGND) U1.T7(E:DGND) U1.T8(E:DGND) U1.T9(E:DGND) U1.T10(E:DGND) U1.T11(E:DGND) U1.T12(E:DGND) U1.T13(E:DGND) U1.T14(E:DGND) U1.T15(E:DGND) U1.T16(E:DGND) U1.T17(E:DGND) U1.U4(E:DGND) U1.U5(E:DGND) U1.U15(A:RTC_KALDO_ENN) U1.U16(E:DGND) U1.U17(E:DGND) U1.W13(B:OSC1_GND) U1.Y1(E:DGND) U1.Y20(E:DGND) U2.4(GND) U4.1(GND) U6.1(*1OE) U6.4(GND) U16.2(GND) U16.5(TESTL) U16.6(XTAMPER) U16.9(GND) U16.18(PIRQ#) U16.19(ATEST) U16.20(TWI_WAKEUP#) U16.21(ATEST) U16.23(GND) U16.24(ATEST) U16.32(GND) U27.33(GND_EP) U28.2(GND) U29.5(GND) U40.3(GND1) VREG1.3(GND) VREG1.5(EN) VREG1.6(GND) VREG2.GND X1.GND X2.8(D_GND) X3.1 X4.4(TDIS) X4.8(GND1) X4.10(GND2) X4.12(GND3) X4.16(GND4) X4.20(GND5) X5.6(VSS) X6.1 X8.3 X24.2
GPIO0_7: U1.V15(C:ECAP0_IN_PWM0_OUT) U29.2(!RE) U29.3(DE)
GPIO0_18: U1.K3(B:USB0_DRVVBUS)
GPIO1_12: IC2.2(I2) U1.C15(C:GPMC_AD12)
GPIO1_13: IC2.3(I3) U1.B15(C:GPMC_AD13)
GPIO1_14: IC2.4(I4) U1.A15(C:GPMC_AD14)
GPIO1_15: IC2.5(I5) U1.C14(C:GPMC_AD15)
GPIO1_16: U1.B14(C:GPMC_CSN3) U40.7(DE)
GPIO1_17: IC2.1(I1) U1.B13(C:GPMC_A1)
GPIO1_28: U1.C9(C:GPMC_BEN1) U40.6(!RE)
I2C0_SCL: R12.1 TP18.P$1(TP) U1.U8(A:PMIC_SCL) U1.V8(A:I2C0_SCL) U16.29(SM_CLK)
I2C0_SDA: R13.1 TP17.P$1(TP) U1.U7(A:PMIC_SDA) U1.V7(A:I2C0_SDA) U16.30(SM_DAT)
I2C2_SCL: R169.1 RTC1.8(SCL) TP20.P$1(TP) U1.Y8(C:UART1_RTSN)
I2C2_SDA: R170.1 RTC1.7(SDA) TP19.P$1(TP) U1.W8(C:UART1_CTSN)
ISO_485_A: D405.1 F401.3 U40.11(Y) U40.14(A)
ISO_485_B: D405.2 F402.3 U40.12(Z) U40.13(B)
ISO_GND: C402.2 C403.2 C405.2 C406.- D405.3 GDT1.3 T4.P$6 T4.P$7 U40.9(GND2_2) U40.15(GND2) VREG4.2(GND) X41.3
ISO_VCC: C402.1 C406.+ U40.16(VCC2) VREG4.5(VOUT)
ISO_VIN: C403.1 C405.1 D403.C D404.C VREG4.1(VIN) VREG4.3(ON/!OFF)
JTAG_EMU0: R40.1 U1.V18(B:EMU0) X4.13(EMU0)
JTAG_EMU1: R41.1 U1.V19(B:EMU1) X4.14(EMU1)
JTAG_TCK: U1.Y19(B:TCK) X4.9(TCKRTN) X4.11(TCK)
JTAG_TDI: U1.Y18(B:TDI) X4.3(TDI)
JTAG_TDO: U1.W18(B:TDO) X4.7(TDO)
JTAG_TMS: U1.W19(B:TMS) X4.1(TMS)
JTAG_TRSTN: R39.2 U1.W20(B:TRSTN) X4.2(TRSTN)
LCD_DATA0: R68.2 R85.1 U1.T18(D:LCD_DATA0) X7.19
LCD_DATA1: R67.2 R84.1 U1.T19(D:LCD_DATA1) X7.20
LCD_DATA2: R66.2 R69.1 R83.1 U1.T20(D:LCD_DATA2) X7.17
LCD_DATA3: R65.2 R82.1 U1.R18(D:LCD_DATA3) X7.18
LCD_DATA4: R64.2 R81.1 U1.R19(D:LCD_DATA4) X7.15
LCD_DATA5: R63.2 R80.1 U1.R20(D:LCD_DATA5) X7.16
LCD_DATA6: R62.2 R79.1 U1.P18(D:LCD_DATA6) X7.13
LCD_DATA7: R61.2 R78.1 U1.P19(D:LCD_DATA7) X7.14
LCD_DATA8: R60.2 R77.1 U1.P20(D:LCD_DATA8) X7.11
LCD_DATA9: R59.2 R76.1 U1.N18(D:LCD_DATA9) X7.12
LCD_DATA10: R58.2 R75.1 U1.N19(D:LCD_DATA10) X7.10
LCD_DATA11: R57.2 R74.1 U1.N20(D:LCD_DATA11) X7.8
LCD_DATA12: R56.2 R73.1 U1.M18(D:LCD_DATA12) X7.9
LCD_DATA13: R55.2 R72.1 U1.M19(D:LCD_DATA13) X7.7
LCD_DATA14: R54.2 R71.1 U1.M20(D:LCD_DATA14) X7.5
LCD_DATA15: R53.2 R70.1 U1.L18(D:LCD_DATA15) X7.6
LCD_DE: R28.2 X7.4
LCD_HSYNC: R29.2 X7.3
LCD_PCLK: R31.2 X7.2
LCD_VSYNC: R30.2 X7.1
LDO_PGOOD: TP22.TP U1.D13(A:RTC_PWRONRSTN) U1.D14(A:PMIC_LDO_PGOOD)
MDIO_CLK: U1.W1(D:MDC) U27.17(MDC)
MDIO_DATA: ER105.2 U1.V1(D:MDIO) U27.16(MDIO)
MII1_COL: ER123.2 U1.R2(D:MII1_COL)
MII1_CRS: ER124.2 U1.R3(D:MII1_CRS)
MII1_RXCLK: ER116.2 U1.T1(D:MII1_RX_CLK)
MII1_RXD0: ER113.2 U1.T3(D:MII1_RXD0)
MII1_RXD1: ER112.2 U1.U1(D:MII1_RXD1)
MII1_RXD2: ER111.2 U1.U2(D:MII1_RXD2)
MII1_RXD3: ER110.2 U1.U3(D:MII1_RXD3)
MII1_RXDV: ER114.2 U1.R1(D:MII1_RX_DV)
MII1_RXERR: ER118.2 U1.T2(D:MII1_RX_ER)
MII1_TXCLK: ER119.2 U1.N1(D:MII1_TX_CLK)
MII1_TXD0: U1.N2(D:MII1_TXD0) U27.22(TXD0)
MII1_TXD1: U1.N3(D:MII1_TXD1) U27.23(TXD1)
MII1_TXD2: U1.P1(D:MII1_TXD2) U27.24(TXD2)
MII1_TXD3: U1.P2(D:MII1_TXD3) U27.25(TXD3)
MII1_TXEN: U1.P3(D:MII1_TX_EN) U27.21(TXEN)
MMC0_CD: R92.1 U1.V4(C:SPI0_CS1) X4.19(EMU4) X5.12(CARD_DETECTION_SWITCH)
MMC0_CLK: R88.1 U1.W3(C:MMC0_CLK) X5.5(CLK)
MMC0_CMD: R87.1 U1.W2(C:MMC0_CMD) X5.3(CMD)
MMC0_DAT0: R89.1 U1.Y3(C:MMC0_DAT0) X5.7(DAT0)
MMC0_DAT1: R90.1 U1.V3(C:MMC0_DAT1) X5.8(DAT1)
MMC0_DAT2: R86.1 U1.V2(C:MMC0_DAT2) X5.1(DAT2)
MMC0_DAT3: R91.1 U1.Y2(C:MMC0_DAT3) X5.2(CD/DAT3)
MODE2: ER99.2 ER123.1 U27.15(COL/CRS_DV/MODE2)
N$1: R10.1 X1.VBUS
N$2: D7.2(C) R35.8
N$3: D31.2(C) R171.1
N$5: D802.2(C) R802.1
N$6: D801.2(C) R801.1
N$7: J51.1 J52.1 R185.1 R254.1 X12.1
N$8: D1.2(C) R26.1
N$9: TP33.TP U1.F18(A:SYS_VDD1_CTL)
N$10: ER117.2 X2.10(GRNC)
N$11: D6.2(C) R35.7
N$13: D5.2(C) R35.6
N$14: J11.1 J12.1 R181.1 R214.1 X10.1
N$15: D4.2(C) R35.5
N$17: C105.1 J24.1 VREG2.IN
N$19: D301.2(C) R301.1
N$20: D302.2(C) R302.1
N$37: C151.1 IC12.3(A:+IN) J53.1 R254.2
N$38: J51.2 R251.2
N$39: J53.2 R253.1
N$40: J52.2 R252.1
N$41: J61.1 J62.1 R186.1 R264.1 X12.3
N$43: C161.1 IC12.5(B:+IN) J63.1 R264.2
N$44: J61.2 R261.2
N$45: J11.2 R211.2
N$46: J12.2 R212.1
N$50: J63.2 R263.1
N$51: J62.2 R262.1
N$52: D401.2(C) R401.1
N$54: J13.2 R213.1
N$55: J21.1 J22.1 R182.1 R224.1 X10.3
N$56: C121.1 IC10.5(B:+IN) J23.1 R224.2
N$60: C111.1 IC10.3(A:+IN) J13.1 R214.2
N$61: J21.2 R221.2
N$62: J23.2 R223.1
N$63: J22.2 R222.1
N$66: J31.1 J32.1 R183.1 R234.1 X11.1
N$67: C131.1 IC11.3(A:+IN) J33.1 R234.2
N$68: J31.2 R231.2
N$69: J33.2 R233.1
N$70: R31.1 U1.U20(D:LCD_PCLK)
N$71: J32.2 R232.1
N$72: R30.1 U1.U18(D:LCD_VSYNC)
N$73: J41.1 J42.1 R184.1 R244.1 X11.3
N$74: C141.1 IC11.5(B:+IN) J43.1 R244.2
N$75: J41.2 R241.2
N$76: J43.2 R243.1
N$78: J42.2 R242.1
N$83: R29.1 U1.U19(D:LCD_HSYNC)
N$85: R28.1 U1.V20(D:LCD_AC_BIAS_EN)
N$86: D402.2(C) R402.1
N$87: D403.A T4.P$8
N$88: D404.A T4.P$5
N$89: T4.P$1 U40.1(D1)
N$90: T4.P$4 U40.2(D2)
N$93: D19.2(C) R168.1
N$94: EC40.1 ER122.2 X2.4(TCT) X2.5(RCT)
N$97: IC4.6(H) R282.5 S12.8
N$98: IC4.5(G) R282.6 S12.4
N$99: IC4.4(F) R282.7 S12.2
N$100: IC4.3(E) R282.8 S12.1
N$101: IC4.14(D) R281.5 S11.8
N$102: IC4.13(C) R281.6 S11.4
N$103: IC4.12(B) R281.7 S11.2
N$104: IC4.11(A) R281.8 S11.1
N$105: IC4.10(SER) IC5.9(QH)
N$106: IC5.11(A) R291.8 S13.8
N$107: IC5.12(B) R291.7 S13.7
N$108: IC5.13(C) R291.6 S13.6
N$109: IC5.14(D) R291.5 S13.5
N$110: G1.+ RTC1.6(VBAT)
N$111: J3.1 R69.2
N$112: D32.2(C) R172.1
N$113: ER126.1 U27.5(XTAL1/CLKIN)
N$114: EC42.1 ER125.2 ER126.2 Y7.P$2
N$115: EC41.1 ER127.2 Y7.P$1
N$116: ER125.1 ER127.1 U27.4(XTAL2)
N$117: ER128.2 U27.32(RBIAS)
N$118: ER129.1 U27.18(NINT/TXER/TXD4)
N$119: IC2.16(O1) K1.2 R171.2
N$120: IC2.15(O2) K2.2 R172.2
N$121: D33.2(C) R173.1
N$122: D34.2(C) R174.1
N$123: D35.2(C) R175.1
N$124: IC2.14(O3) K3.2 R173.2
N$125: EC33.1 EC35.1 U27.6(VDDCR)
N$126: ER115.2 X2.11(YELC)
N$128: IC2.13(O4) K4.2 R174.2
N$129: IC2.12(O5) K5.2 R175.2
N$130: R15.2 R20.1 U5.1(REF)
N$131: Q1.B R21.1 U5.2(CATHODE)
N$133: R4.1 U1.W14(C:XDMA_EVENT_INTR0)
N$134: R11.1 S1.1 S1.3
N$135: R8.2 U4.2(RESET#)
N$137: R5.2 R11.2 U4.3(MR#)
N$138: R3.1 U1.V14(C:XDMA_EVENT_INTR1)
OSC1_IN: R164.2 RTC1.1(32KHZ) U1.Y13(B:OSC1_IN)
OSC1_OUT: U1.Y14(B:OSC1_OUT)
OSC_CTL: TP32.TP U1.M1(B:OSC0_CTL)
PMIC_INT: TP24.TP U1.J17(A:PMIC_NINT) U1.K17(A:EXTINTN)
PMIC_MUX_IN: R18.2 R22.1 U1.F19(B:PMIC_MUX_IN)
PMIC_NRESET: J2.1 U1.A19(A:PMIC_NRESET)
PMIC_NWAKEUP: TP23.TP U1.G17(A:PMIC_NWAKEUP) U1.H17(A:EXT_WAKEUP)
PMIC_PGOOD: TP26.TP U1.D11(A:PWRONRSTN) U1.D12(A:PMIC_PGOOD)
PR1_PRU0_PRU_R30_6: U1.V17(C:MCASP0_AXR1)
PR1_PRU0_PRU_R30_7: U1.V16(C:MCASP0_AHCLKX)
PR1_UART0_RXD: U1.W4(C:SPI0_D1)
PR1_UART0_TXD: U1.Y4(C:SPI0_CS0)
PWR_BUT: S2.2 S2.4 U1.A18(A:PMIC_PB_IN)
PWR_EN: TP21.TP U1.D9(A:PMIC_POWER_EN) U1.D10(A:PMIC_PWR_EN)
PWRONRSTN: R5.1 U1.C17(A:PWRONRSTN_OD)
RTC_RST: R163.1 RTC1.4(RST) U1.K20(C:GPMC_CSN0)
RX_CLK: ER104.1 ER116.1 U27.7(RXCLK/PHYAD1)
RX_DV: ER114.1 U27.26(RXDV)
RX_ERR: ER101.1 ER118.1 U27.13(RXER/RXD4/PHYAD0)
RX_N: EC37.1 ER107.2 U27.30(RXN) X2.6(RXN)
RX_P: EC36.1 ER106.2 U27.31(RXP) X2.3(RXP)
RXD0: ER98.2 ER113.1 U27.11(RXD0/MODE0)
RXD1: ER100.2 ER112.1 U27.10(RXD1/MODE1)
RXD2: ER103.1 ER111.1 U27.9(RXD2/RMIISEL)
RXD3: ER102.1 ER110.1 U27.8(RXD3/PHYAD2)
SPI1_CS0: IC4.1(SH/!LD) IC5.1(SH/!LD) U1.W17(C:MCASP0_AHCLKR)
SPI1_D0: IC4.9(QH) U1.Y16(C:MCASP0_FSX)
SPI1_D1: U1.W16(C:MCASP0_AXR0)
SPI1_SCLK: IC4.2(CLK) IC5.2(CLK) U1.Y17(C:MCASP0_ACLKX)
SYS_ADC_1P8V: C10.1 IC14.3(A:+IN) IC14.5(B:+IN) R33.2 U1.Y12(B:SYS_ADC_1P8V)
SYS_RESETN: C14.1 R6.2 R8.1 TP31.TP U1.B17(A:WARMRSTN) U16.17(LRESET#) U27.19(!RST) X4.15(SRST)
SYS_RTC_1P8V: Q1.C R15.1 TP14.TP U1.K13(A:SYS_RTC_1P8V) U1.K14(A:SYS_RTC_1P8V) U1.L13(A:SYS_RTC_1P8V) U1.L14(A:SYS_RTC_1P8V) U1.M13(A:VDDS_RTC) U1.M14(A:VDDS) U5.3(ANODE)
SYS_VDD1_3P3V: C6.2 C15.1 C21.1 C22.1 C79.1 C85.1 C87.1 C88.1 C104.1 C301.1 C401.1 C404.1 C801.1 EC34.1 ER98.1 ER99.1 ER100.1 ER105.1 FB7.1 IC14.8(A:V+) R12.2 R13.2 R22.2 R40.2 R41.2 R70.2 R71.2 R72.2 R73.2 R74.2 R75.2 R76.2 R77.2 R78.2 R79.2 R80.2 R81.2 R82.2 R83.2 R84.2 R85.2 R86.2 R87.2 R88.2 R89.2 R90.2 R91.2 R92.2 R163.2 R164.1 R169.2 R170.2 R303.2 RTC1.2(VCC) S11.C S12.C S13.1 S13.2 S13.3 S13.4 T4.P$2 T4.P$3 TP12.TP U1.F8(A:EMMC_VCC) U1.F9(A:EMMC_VCC) U1.G8(A:EMMC_VCC) U1.G9(A:EMMC_VCC) U1.H7(A:EMMC_VCCQ) U1.H8(A:EMMC_VCCQ) U1.H14(A:SYS_VDD1_3P3V) U1.H15(A:SYS_VDD1_3P3V) U1.J7(A:EMMC_VCCQ) U1.J8(A:EMMC_VCCQ) U1.J14(A:SYS_VDD1_3P3V) U1.J15(A:SYS_VDD1_3P3V) U4.4(VCC) U6.7(2OE) U6.8(VCC) U16.1(VCC) U16.8(VCC) U16.22(VCC) U27.12(VDDIO) U28.3(VCC) U29.8(VCC) U40.4(VCC1) X4.5(TVDD) X5.4(VDD)
SYS_VDD2_3P3V: D1.1(A) TP13.TP U1.F12(A:SYS_VDD2_3P3V) U1.F13(A:SYS_VDD2_3P3V) U1.G12(A:SYS_VDD2_3P3V) U1.G13(A:SYS_VDD2_3P3V)
SYS_VDD3_3P3V: Q1.E R20.2 R21.2 TP16.TP U1.K10(A:SYS_VDD3_3P3V) U1.K11(A:SYS_VDD3_3P3V) U1.L7(A:SYS_VDD3_3P3V) U1.L8(A:SYS_VDD3_3P3V) U1.L9(A:SYS_VDD3_3P3V) U1.L10(A:SYS_VDD3_3P3V) U1.L11(A:SYS_VDD3_3P3V) U1.L12(A:SYS_VDD3_3P3V) U1.M7(A:VDDSHV4) U1.M8(A:VDDSHV5) U1.M9(A:VDDSHV3) U1.M10(A:VDDSHV2) U1.M11(A:VDDSHV1) U1.M12(A:VDDSHV6)
SYS_VDD_1P8V: TP15.TP U1.N7(A:SYS_VDD_1P8V) U1.N8(A:SYS_VDD_1P8V) U1.N9(A:SYS_VDD_1P8V) U1.N10(A:SYS_VDD_1P8V) U1.N11(A:SYS_VDD_1P8V) U1.N12(A:SYS_VDD_1P8V) U1.N13(A:SYS_VDD_1P8V) U1.N14(A:SYS_VDD_1P8V) U1.P10(A:SYS_VDD_1P8V) U1.P11(A:SYS_VDD_1P8V)
SYS_VOUT: C4.1 TP11.TP U1.F14(A:SYS_VOUT) U1.F15(A:SYS_VOUT) U1.G14(A:SYS_VOUT) U1.G15(A:SYS_VOUT)
TEMP_SENSE: TP7.P$1(TP) U1.E20(A:PMIC_TS)
TPM_GPIO0: U1.W15(C:MCASP0_FSR) U16.12(GPIO)
TPM_GPIO1: TP9.P$1(TP) U1.V6(C:UART0_CTSN) U16.3(GPIO-EXPRESS-00)
TPM_GPIO2: TP10.P$1(TP) U1.V5(C:UART0_RTSN) U16.4(PP/GPIO)
TX_CLK: ER119.1 U27.20(TXCLK)
TX_N: EC39.1 ER109.2 U27.28(TXN) X2.2(TXN)
TX_P: EC38.1 ER108.2 U27.29(TXP) X2.1(TXP)
UART0_RX: U1.Y6(C:UART0_RXD) U6.6(1Y)
UART0_TX: U1.W6(C:UART0_TXD) U6.5(2A)
UART2_RXD: D302.1(A) U1.Y5(C:SPI0_SCLK) U29.1(RO)
UART2_TXD: D301.1(A) U1.W5(C:SPI0_D0) U29.4(DI)
UART4_RXD: D402.1(A) U1.B9(C:GPMC_WAIT0) U40.5(R)
UART4_TXD: D401.1(A) U1.A9(C:GPMC_WPN) U40.8(D)
USB0_ID: U1.L1(B:USB0_ID) U2.3(ID) X1.ID
USB0_N: U1.K2(B:USB0_DM) U2.1(D-) X1.D-
USB0_P: U1.L2(B:USB0_DP) U2.2(D+) X1.D+
USR0: D7.1(A) U1.C12(C:GPMC_A5)
USR1: D6.1(A) U1.A11(C:GPMC_A6)
USR2: D5.1(A) U1.B11(C:GPMC_A7)
USR3: D4.1(A) U1.C11(C:GPMC_A8)
VDD_5V: C11.+ C102.1 L2.2 U1.C18(A:VIN_AC) U1.C19(A:VIN_AC) U1.C20(A:VIN_AC) VREG1.4(FB)
VDD_BAT: TP5.P$1(TP) U1.D18(A:VIN_BAT) U1.D19(A:VIN_BAT) U1.D20(A:VIN_BAT)
VDD_CORE: TP4.TP U1.U13(F:VDD_CORE)
VDD_ETH_PHY: EC30.1 EC31.1 EC32.1 ER106.1 ER107.1 ER108.1 ER109.1 ER122.1 FB7.2 U27.1(VDD2A) U27.27(VDD1A)
VDD_MPU: TP1.TP U1.U6(F:VDD_MPU)
VDD_USB_5V: C3.1 R10.2 U1.B18(A:VIN_USB) U1.B19(A:VIN_USB) U1.B20(A:VIN_USB) U1.K1(B:USB0_VBUS) U2.6(VBUS)
VDDS_DDR: TP2.TP U1.U9(F:VDDS_DDR)
VDDS_PLL: TP3.TP U1.U10(F:VDDS_PLL)
VREFN: R25.1 U1.W9(B:VREFN)
VREFP: C8.1 C9.1 R33.1 U1.W12(B:VREFP)
XDMA_EVENT_INTR0: C1.2 R4.2 X4.17(EMU2)
Unconnected: F401.2 F402.2 FUD1.P$1 FUD2.P$1 FUD3.P$1 FUD4.P$1 FUD5.P$1 FUD6.P$1 G1.+@1(+) IC2.6(I6) IC2.7(I7) IC2.10(O7) IC2.11(O6) IC4.7(!QH) IC5.7(!QH) K1.NC(2:O) K2.NC(2:O) K3.NC(2:O) K4.NC(2:O) K5.NC(2:O) RTC1.3(SQW) U1.A2(G:NC) U1.A3(G:NC) U1.A4(C:EMMC_RSTN) U1.A5(G:NC) U1.A6(G:NC) U1.A7(G:NC) U1.A8(G:NC) U1.A10(C:GPMC_A9) U1.A13(C:GPMC_A0) U1.A14(C:GPMC_CLK) U1.A16(C:GPMC_AD11) U1.B1(G:NC) U1.B2(G:NC) U1.B3(G:NC) U1.B4(G:NC) U1.B5(G:NC) U1.B6(G:NC) U1.B7(G:NC) U1.B8(G:NC) U1.B10(C:GPMC_A10) U1.B12(C:GPMC_A4) U1.B16(C:GPMC_AD10) U1.C1(G:NC) U1.C2(G:NC) U1.C3(G:NC) U1.C4(G:NC) U1.C5(G:NC) U1.C6(G:NC) U1.C7(G:NC) U1.C8(G:NC) U1.C10(C:GPMC_A11) U1.D1(G:NC) U1.D2(G:NC) U1.D3(G:NC) U1.D6(G:NC) U1.D7(G:NC) U1.D8(G:NC) U1.E1(G:NC) U1.E2(G:NC) U1.E3(G:NC) U1.E18(G:NC) U1.F1(G:NC) U1.F2(G:NC) U1.F3(G:NC) U1.F4(G:NC) U1.F6(G:NC) U1.F7(G:NC) U1.F20(G:NC) U1.G1(G:NC) U1.G2(G:NC) U1.G3(G:NC) U1.G4(G:NC) U1.G6(G:NC) U1.G7(G:NC) U1.G10(G:NC) U1.G11(G:NC) U1.G18(G:NC) U1.G19(G:NC) U1.G20(G:NC) U1.H1(B:USB1_VBUS) U1.H2(B:USB1_DM) U1.H3(B:USB1_DRVVBUS) U1.H4(G:NC) U1.H6(G:NC) U1.H9(G:NC) U1.H10(G:NC) U1.H11(G:NC) U1.H12(G:NC) U1.H13(G:NC) U1.H18(G:NC) U1.H19(G:NC) U1.H20(G:NC) U1.J1(B:USB1_ID) U1.J2(B:USB1_DP) U1.J3(B:USB1_CE) U1.J4(G:NC) U1.J6(G:NC) U1.J18(G:NC) U1.J19(G:NC) U1.J20(G:NC) U1.K4(G:NC) U1.K18(C:GPMC_WEN) U1.K19(C:GPMC_OEN_REN) U1.L3(B:USB0_CE) U1.L4(G:NC) U1.L17(G:NC) U1.L19(C:GPMC_ADVN_ALE) U1.L20(C:GPMC_BEN0_CLE) U1.M3(D:RMII1_REF_CLK) U1.M4(G:NC) U1.M6(G:NC) U1.M17(G:NC) U1.N4(G:NC) U1.N17(G:NC) U1.P4(G:NC) U1.P17(G:NC) U1.R4(G:NC) U1.R6(G:NC) U1.R7(G:NC) U1.R8(G:NC) U1.R13(G:NC) U1.R14(G:NC) U1.R15(G:NC) U1.R17(G:NC) U1.U11(G:NC) U1.U14(A:VDDS_RTC) U1.V13(F:CAP_VDD_RTC) U1.Y15(C:MCASP0_ACLKR) U2.5(N.C.) U16.7(NC) U16.10(NC) U16.11(NC) U16.13(NC) U16.14(NC) U16.15(NC) U16.16(NC) U16.25(NC) U16.26(NC) U16.27(NC) U16.28(NC) U16.31(NC) U16.33(PAD) U28.8(S) U40.10(NC) VREG4.4(BYPASS) X2.7(NC) X4.6(NC) X6.2 X6.3 X6.6

## Notes on the sheet
- Notes
- Rev 0:  
      1)  Initial Test Prototype.
- Rev 1:  
      1)  Revised Prototype.
- 13/15 | 2 | 14/15 | 2 | 15/15 | 2
- Power Supply | Universal Inputs | Relay Outputs
- UI-1 Jumper:
  Therm / Relay
- UI-1 Jumper:
  4-20mA
- UI-1 Jumper:
  0-10V
- UI-2 Jumper:
  Therm / Relay
- UI-2 Jumper:
  4-20mA
- UI-2 Jumper:
  0-10V
- UI-3 Jumper:
  Therm / Relay
- UI-3 Jumper:
  4-20mA
- UI-3 Jumper:
  0-10V
- UI-4 Jumper:
  Therm / Relay
- VAC
- VDC
- UI-4 Jumper:
  4-20mA
- UI-4 Jumper:
  0-10V
- UI-5 Jumper:
  Therm / Relay
- UI-5 Jumper:
  4-20mA
- UI-5 Jumper:
  0-10V
- UI-6 Jumper:
  Therm / Relay
- UI-6 Jumper:
  4-20mA
- UI-6 Jumper:
  0-10V
- 10/15 | 2 | 11/15 | 2 | 12/15 | 2
- Isolated RS-485 Interface | 10/100BASE-T Ethernet
- Local Network RS-485
- Future AO Connect
- PHY Configuration
- CAN Interface | LCD Header
- 7/15 | 2 | 8/15 | 2 | 9/15 | 2
- SiP GND & Misc | Boot configuration | Micro SD card slot
- External Real Time Clk | User Config Switches
- SYSBOOT[15:0] functionality can be found
  in the "SYSBOOT Configuration Pins" section
  of the AM335x TRM (spruh73)
- SYSBOOT[15:0] = 0x401C (default)
    - Boot Order: MMC1, MMC0, UART0, USB0
  
  SYSBOOT[15:0] = 0x4018 (SD boot)
    - Boot Order: SPI0, MMC0, USB0, UART0
- BOOT Select Jumper:
  On for SDC Boot
- Configuration:
    - 24 MHz Crystal (SYSBOOT[14:15] = 01b)
    - CLKOUT1 disabled (SYSBOOT[5] = 0b)
- JTAG Header | TPM | ONES
- TENS
- Half of these resistors, i.e. the ones marked 
  with 'DNI', can be removed.  Only 16 resistors 
  are needed in order to select the default boot 
  mode.  The button above is used to choose an 
  optional SD card boot mode.
- User LEDs
- Mounting Holes | Fiducials
- Mounting holes and other connector shields are part
  of a ground ring, CGND.  This ring is connected to 
  ground via a resistor on Page 1.
- Only connect EMU2, EMU3 and EMU4 if you plan to use advanced JTAG features 
  (HS-RTDX, Core Trace, System Trace, etc) of higher end debuggers:
  
      - http://processors.wiki.ti.com/index.php/JTAG_Connectors
      - http://processors.wiki.ti.com/index.php/XDS_Target_Connection_Guide
- 4/15 | 2 | 5/15 | 2 | 6/15 | 2
- Power & Reset | Clocks, Analog & USB | SiP Interfaces
- The values for C7 and C12 can be calculated using
  information in FAQ: https://octavosystems.com/faqs/design-oscillator-circuit-osd335x-family-devices/#more-3862
- Clock resistors R32 and R24 may not be needed in your design.
  See https://octavosystems.com/osd335x/clock/ for more information.
- If the analog interface is not used, 
  then VREFP and VREFN should be 
  shorted to AGND.
- THERE IS NO WARRANTY FOR THIS DESIGN, TO THE EXTENT 
  PERMITTED BY APPLICABLE LAW. EXCEPT WHEN OTHERWISE 
  STATED IN WRITING THE COPYRIGHT HOLDERS AND/OR OTHER 
  PARTIES PROVIDE THE DESIGN *AS IS* WITHOUT WARRANTY OF 
  ANY KIND, EITHER EXPRESSED OR IMPLIED, INCLUDING, BUT NOT 
  LIMITED TO, THE IMPLIED WARRANTIES OF MERCHANTABILITY 
  AND FITNESS A FOR A PARTICULAR PURPOSE. THE ENTIRE RISK 
  AS TO THE QUALITY AND PERFORMANCE OF THE DESIGN IS WITH 
  YOU. SHOULD THE DESIGN PROVE DEFECTIVE, YOU ASSUME THE 
  COST OF ALL NECESSARY SERVICING, REPAIR OR CORRECTION.
- UART0 debug header
- SYS_ADC_1P8V and AGND_ADC are connected
  to SYS_VDD_1P8V and DGND, respectively, 
  through ferrite beads inside the SiP.  It is 
  not necessary to connect these rails to 
  anything else.  However, bypass capacitors 
  should be added to reduce noise, if needed 
  for your application.
- Battery Connector
- Maximum voltage for the analog 
  inputs is 1.8V.
- The OSD335x-SM contains 
  4.7k pull-up resistors on I2C0.
  External resistors added so
  that pull-up strength can be
  changed due to layout or
  other requirements.
- AIN7 currently monitors the PMIC voltages 
  via the internal PMIC mux.  See the `Analog 
  Multiplexer' section of the TPS65217 
  datasheet.  For the internal PMIC voltages, 
  there are dividers within the PMIC to keep 
  the montiored voltages under 1.8V.  However, 
  PMIC_MUX_IN does not have any dividers 
  and must be less than 1.8V.  By default, 
  PMIC_MUX_OUT is Hi-Z.  The MUXCTRL 
  register in the PMIC is used to select the 
  PMIC_MUX_OUT voltage path.
- TPS65217 I2C Address:  0x24
- DS3231 I2C Address:  0x68
- EEPROM I2C Address:  0x50
- This is a clamping circuit between the VDDS 
  and VDDSHV inputs of the AM335x inside the 
  OSD335x-SM.  The clamping circuit is related to 
  power down issues (see 
  https://octavosystems.com/osd335x/clamping/ 
  for more information). This may not be needed in 
  your application if the power down conditions do 
  not apply to your application.
- AT97SC3205T I2C Address:  0x29
- The 0 Ohm resistor (R10) on the 
  VBUS input can be replaced with 
  a ferrite bead for noise 
  suppresion or a solder bridge 
  for cost reduction.
- SYS_VDD1_3P3V is a 3.3V output of the 
  OSD3358-512M-ICB.  A divide by 2 resistor 
  divider is used to ensure that the PMIC_MUX_IN 
  voltage does not exceed 1.8V.  It is not 
  necessary to monitor the TL5209 LDO output 
  and this can be removed if desired.
- RTC_KALDO_ENN is grounded thru a 10K ohm resistor so that 
  the internal RTC LDO is enabled and CAP_VDD_RTC does not 
  need to be connected to VDD_CORE.
- USB Client
- Reset supervisor circuit:
  Reset asserted if VCC
  drops below V threshold,
  push button or POR.
  De-asserted after 240ms
- Reset inputs:
      1) Manual push-button
      2) PMIC_PGOOD
  Reset supervisor MR# has internal pull up to SYS_VDD1_3P3V.  
  Each reset input is effectively open drain and can only pull 
  reset line low. Resistors added only for debug and are not 
  necessary.
- To Print:  Use 8.5"x11" 
  paper in landscape; 
  0.69 scaling factor.
- 1/15 | 2 | 2/15 | 2 | 3/15 | 2

## Power pins joined to a net without a drawn wire
GND: IC4.8(GND) IC5.8(GND)
VCC: IC4.16(VCC) IC5.16(VCC)
VIO: U28.5(VIO)

## Library data of the parts
C1-C4 C6 C8-C10 C14 C15 C21 C22 C79 C85 C87 C88 C104 C111 C121 C131 C141 C151 C161 C301 C401-C405 C801 EC30-EC42 = OSD3358-SM-RED Platform:C: Capacitor SMD. Sizes: 0402, 0603 & 0805
C11 C406 = OSD3358-SM-RED Platform:CPOL-US: POLARIZED CAPACITOR, American symbol
C100 = OSD3358-SM-RED Platform:UHE1H102MHD6: Capacitor UHE 1000uF, 50V 16X25mm, -40~105C. 10,000 Hours@105C; MANUFACTURER_PART_NUMBER: UHE1H102MHD6; VENDOR: Nichicon
C101 C102 C105 C106 = SparkFun-Capacitors:4.7UF: 4.7µF ceramic capacitors A capacitor is a passive two-terminal electrical component used to store electrical energy temporarily in an electric field.; PROD_ID: CAP-10300; VALUE: 4.7uF
D1 D302 D402 D801 = OSD3358-SM-RED Platform:LTST-C191KFKT: PointLED® Enhanced Thinfilm LED TOP & BOTTOM mount EIA-STD, P47F
D3 = diode:S1M
D4-D7 D301 D401 D802 = OSD3358-SM-RED Platform:LTST-C191KGKT: PointLED® Enhanced Thinfilm LED TOP & BOTTOM mount EIA-STD, P47F, GREEN
D18 = OSD3358-SM-RED Platform:B520C-13-F: Schottky barrier diode Source: www.st.com, BAT60J.pdf
D19 D31-D35 = OSD3358-SM-RED Platform:LTST-C191KRKT: PointLED® Enhanced Thinfilm LED TOP & BOTTOM mount EIA-STD, P47F, RED
D305 D405 = OSD3358-SM-RED Platform:SM712: Asymmetrical TVS Diode Array RS-485
D403 D404 = diode:MBR0520LT: SCHOTTKY BARRIER RECTIFIER Source: http://onsemi.com .. MBR0520LT1-D.pdf
D805 = OSD3358-SM-RED Platform:CDSOT23-T24CAN: CAN Bus TVS Diode Array
ER98-ER120 ER122-ER129 R3 R4 R10 R12 R13 R18 R22 R25-R31 R33 R34 R39-R41 R53-R92 R163 R164 R168-R175 R212-R214 R222-R224 R232-R234 R242-R244 R252-R254 R262-R264 R301-R305 R401 R402 R801 R802 = OSD3358-SM-RED Platform:R-US_: RESISTOR, American symbol
F1 = SparkFun-Fuses:PPTC: Resettable Fuse PPTC Resettable Fuse. Really a sort of resistor with a polymeric positive temperature coefficient whose resistance increases dramatically with an increase in temperature. When heated by the power passing through the resistance rises causing the current to be limited, protecting the circuit. This is achieved by the transition of the polymer from a crystalline to an amorphous state where the conductive carbon separates breaking the conductive pathways found in the cool crystalline structure. When a PPTC cools back down it resumes conducting letting the circuit turn back on. SparkFun Products: SparkFun RedBoard - Programmed with Arduino <https://www.sparkfun.com/products/12757> Pro Micro - 5V/16MHz <https://www.sparkfun.com/products/12640> Arduino Pro 328 - 5V/16MHz <https://www.sparkfun.com/products/10915> MP3 Trigger <https://www.sparkfun.com/products/13720>; PROD_ID: RES-08490; VALUE: 72V/0.25A
F401 F402 = OSD3358-SM-RED Platform:TBU-CA085-300-WH: Surge Supp TBU 300mA 850VImp SMD
FB7 = OSD3358-SM-RED Platform:BLM21AG151SN1D: INDUCTOR SMD Ferrite Bead Packages: 0805, 1206
FUD1-FUD6 = OSD3358-SM-RED Platform:FIDUCIAL
G1 = battery:CR2032V: LI BATTERY Varta
GDT1 = OSD3358-SM-RED Platform:2036-09-B3: Gas Discharge Tube 90V 20% 10kA Through Hole
IC2 = uln-udn:ULN2003A: DRIVER ARRAY
IC4 IC5 = 74xx-eu:74*165: 8-bit parallel load SHIFT REGISTER
IC10-IC12 IC14 = adam - ics:MCP6002: Dual General Op Amp 1.8V min supply 1MHz (6V/us)
J1 = OSD3358-C-SiP-RED Platform:826646-2: 2-pin 100 mil header
J2-J6 J11-J13 J21-J23 J31-J33 J41-J43 J51-J53 J61-J63 = OSD3358-SM-RED Platform:826646-2: 2-pin 100 mil header
J24 = OSD3358-SM-RED Platform:826646-3: 6-pin 100 mil header; MPN: P125-1106A1BS116A1
K1-K5 = relay:JS-M1*: Automotive Ultra-Miniature Power Relay NAiS Source: http://www.mew-europe.com/.. en_ds_61211_0000.pdf; MF: FARNELL; MPN: JSM1-12V-5; OC_FARNELL: 910351; OC_NEWARK: 14J1764
L2 = inductor-coilcraft_l:MSS1260: SMT Power Inductor
MGT1-MGT4 = OSD3358-SM-RED Platform:MOUNTING_HOLE: Chassis Mounting Hole w/GND connection ability
Q1 = OSD3358-C-SiP-RED Platform:MMBT2907*: PNP Transistror
R5 R6 R8 R11 R15 R20 R21 = OSD3358-C-SiP-RED Platform:R-US_: RESISTOR, American symbol
R35 R281 R282 R291 = GHI-BasicComponents:RESISTOR.NETWORK-(4)
R181-R186 = varistor:VARISTOR: VARISTOR
R211 R221 R231 R241 R251 R261 = resistor:R-US_: RESISTOR, American symbol
RTC1 = SparkFun-Clocks:DS3231M: DS3231M Real Time Clock Accuracy +/-5ppm. Battery Backup. 2.3V to 5.5V. Datasheet <https://cdn.sparkfun.com/datasheets/Dev/Beagle/DS3231M.pdf> SparkFun Products CryptoCape <https://www.sparkfun.com/products/12773> (DEV-12773) SparkFun CryptoShield <https://www.sparkfun.com/products/13183> (DEV-13183); PROD_ID: IC-11985
S1 = OSD3358-C-SiP-RED Platform:KMR231GLFS
S2 = OSD3358-SM-RED Platform:KMR231GLFS
S11 S12 = switch-dil:P101: DIL/CODE SWITCH; OC_FARNELL: unknown; OC_NEWARK: unknown
S13 = switch-dil:DS04: DIL/CODE SWITCH; OC_FARNELL: 9471570; OC_NEWARK: unknown
T4 = OSD3358-SM-RED Platform:DA2304-AL: Coilcraft Isolation/Power Transformer, Step Up 3.3 to 5V
TP1-TP4 TP11-TP16 TP21-TP24 TP32 TP33 = OSD3358-SM-RED Platform:TP: Test pad
TP5-TP10 TP17-TP20 = OSD3358-SM-RED Platform:TESTPAD/W_HOLE_1X1: Test point (Through hole)
TP26 TP31 = OSD3358-C-SiP-RED Platform:TP: Test pad
U1 = Octavo-Systems:OSD3358-512M-ICB: Octavo Systems LLC OSD335x Family SiP: 27mm x 27mm, 1.27mm pitch 400 pin BGA contains AM3358, 512MB DDR3, TPS65217, TL5209, 4KB EEPROM, 4GB eMMC, 24MHz oscillator, and passives. Industrial Temperature (case): -40C to 85C.
U2 = OSD3358-SM-RED Platform:TPD4S012_DRY_6; DATASHEETURL: http://www.ti.com/lit/gpn/TPD4S012; FAMILY_NAME: ESD Solution; GENERIC_PART_NUMBER: TPD4S012; INDUSTRY_STD_PKG_TYPE: SON; MANUFACTURER: Texas Instruments; MANUFACTURER_PART_NUMBER: tpd4s012_dry_6; PACKAGE_DESIGNATOR: DRY; PIN_COUNT: 6; VENDOR: Texas Instruments
U4 = OSD3358-C-SiP-RED Platform:APX811-31UG: Diodes APX811/812 4-pin Microprocessor Supervisor with Manual Reset. Datasheet <https://www.diodes.com/assets/Datasheets/APX811_812.pdf> Footprint <https://www.diodes.com/assets/Package-Files/SOT143.pdf> Digikey <http://www.digikey.com/products/en?keywords=APX811-29UG-7DICT-ND> Footprint compatible devices: STM811 <http://www.st.com/content/st_com/en/products/reset-and-supervisor-ics/resets-and-voltage-detectors/stm811.html> Digikey <http://www.digikey.com/product-detail/en/stmicroelectronics/STM811SW16F/497-3348-1-ND> STM6315 <http://www.st.com/content/st_com/en/products/reset-and-supervisor-ics/resets-and-voltage-detectors/stm6315.html> Digikey <http://www.digikey.com/product-detail/en/stmicroelectronics/STM6315SDW13F/497-4975-1-ND> ADM811
U5 = OSD3358-C-SiP-RED Platform:TLVH431
U6 = OSD3358-SM-RED Platform:SN74LVC2G241_DCU_8; DATASHEETURL: http://www.ti.com/lit/gpn/SN74LVC2G241; FAMILY_NAME: LL BUFFER AND DRIVER WITH 3-STATE OUTPUT; GENERIC_PART_NUMBER: SN74LVC2G241; INDUSTRY_STD_PKG_TYPE: US8; MANUFACTURER: Texas Instruments; MANUFACTURER_PART_NUMBER: sn74lvc2g241_dcu_8; PACKAGE_DESIGNATOR: DCU; PIN_COUNT: 8; VENDOR: Texas Instruments
U16 = OSD3358-SM-RED Platform:AT97SC3205T-G3M4400B: Trusted Platform Module
U27 = OSD3358-SM-RED Platform:LAN8710
U28 = BeagleBone_Blue:TCAN1051HV; DATASHEETURL: http://www.ti.com/lit/ds/symlink/tcan1051hv.pdf; DESCRIPTION: CAN Transceiver; FAMILY_NAME: CAN Transceiver; GENERIC_PART_NUMBER: TCAN1051HV; INDUSTRY_STD_PKG_TYPE: SOIC; MANUFACTURER: Texas Instruments; MANUFACTURER_PART_NUMBER: TCAN1051HVD; PACKAGE_DESIGNATOR: D; PIN_COUNT: 8; VENDOR: Texas Instruments
U29 = OSD3358-SM-RED Platform:MAX3483EESA+T; MANUFACTURER_PART_NUMBER: MAX3483EESA+T; VENDOR: Maxim Integrated Products
U40 = ISO3086TDW:ISO3086TDW; MANUFACTURER_PART_NUMBER: ISO3086TDW; VENDOR: Texas Instruments
VREG1 = linear:LM2596S: STEP-DOWN VOLTAGE REGULATOR
VREG2 = v-reg:78XXL: VOLTAGE REGULATOR
VREG4 = LP2985A-33DBVR:LP2985A-33DBVR; MANUFACTURER_PART_NUMBER: LP2985A33DBVR; VENDOR: Texas Instruments
X1 = OSD3358-SM-RED Platform:10118194-0001LF: Amphenol FCI Micro USB Type B Complete Through Hole Support Legs (PTH) with guide holes
X2 = OSD3358-SM-RED Platform:J0011D01BNL: Ethernet Connector MagJack 1 Port 100 BASE TX Pulse Electronics
X3 X8 X10-X12 = con-phoenix-381_l:MC4: Mini-Combicon 3.81mm horizontal 4-polig MC 1,5/4-G-3,81 Artikel-Nr. 1803293
X4 = OSD3358-SM-RED Platform:CTI-JTAG
X5 = SamacSys_Parts:DM3CS-SF: MicroSD card connector, push-pull type MicroSD card connector, push-pull type Source: Datasheet <https://componentsearchengine.com/Datasheets/1/DM3CS-SF.pdf>; DESCRIPTION: MicroSD card connector, push-pull type MicroSD card connector, push-pull type; HEIGHT: mm; MANUFACTURER_NAME: Hirose; MANUFACTURER_PART_NUMBER: DM3CS-SF; MOUSER_PART_NUMBER: 798-DM3CSSF; MOUSER_PRICE-STOCK: https://www.mouser.com/Search/Refine.aspx?Keyword=798-DM3CSSF
X6 = OSD3358-SM-RED Platform:826646-6: 6-pin 100 mil header; MPN: P125-1106A1BS116A1
X7 = OSD3358-SM-RED Platform:TH-2X10: 20 Pin Header 0.100 inch spacing
X21 = con-phoenix-381_l:MC10: Mini-Combicon 3.81mm horizontal 10-polig MC 1,5/10-G-3,81 Artikel-Nr. 1803358
X24 = con-phoenix-508:MSTBA2: PHOENIX; MF: FARNELL; MPN: 1757242; OC_FARNELL: 3705171; OC_NEWARK: 71C4161
X41 = con-phoenix-508:MSTBA3: PHOENIX; MF: FARNELL; MPN: 1757255; OC_FARNELL: 3705183; OC_NEWARK: 71C4162
Y7 = OSD3358-SM-RED Platform:7A-25.000MAAE-T: 25MHz crystal

## Net classes
0 default: width 0.127 mm, drill 0.254 mm
1 ground: width 0.152 mm, drill 0.254 mm, clearance 0.152 mm